# Altium project Luna v2.PrjPcb (part 3 of 7)

## Sheet 06 MIMXRT1170 PART2.SchDoc: Luna v2
size A2; VersionControl_RevNumber: DNP; IsUserConfigurable: DNP; OrgAddr3: Sunrise FL 33323; OrgName: Pixels on Target; Page Create Date: March  8, 1995; Page Number: 5; Page Size: A2; Page Count: 14; OrgAddr2: Suite #104; RevCode: A; Doc: SCH30-00070-00; DsnPath: C:\Users\Carter Nichols\Documents\BitBucket boards (Cadence)\30-00070-00_Original\SCH30-00070-00.DSN; SchematicName: SC30-00070-00; PageName: 05-POWER IN; PageSize: A2; TopSchematic: True; Address4: United States
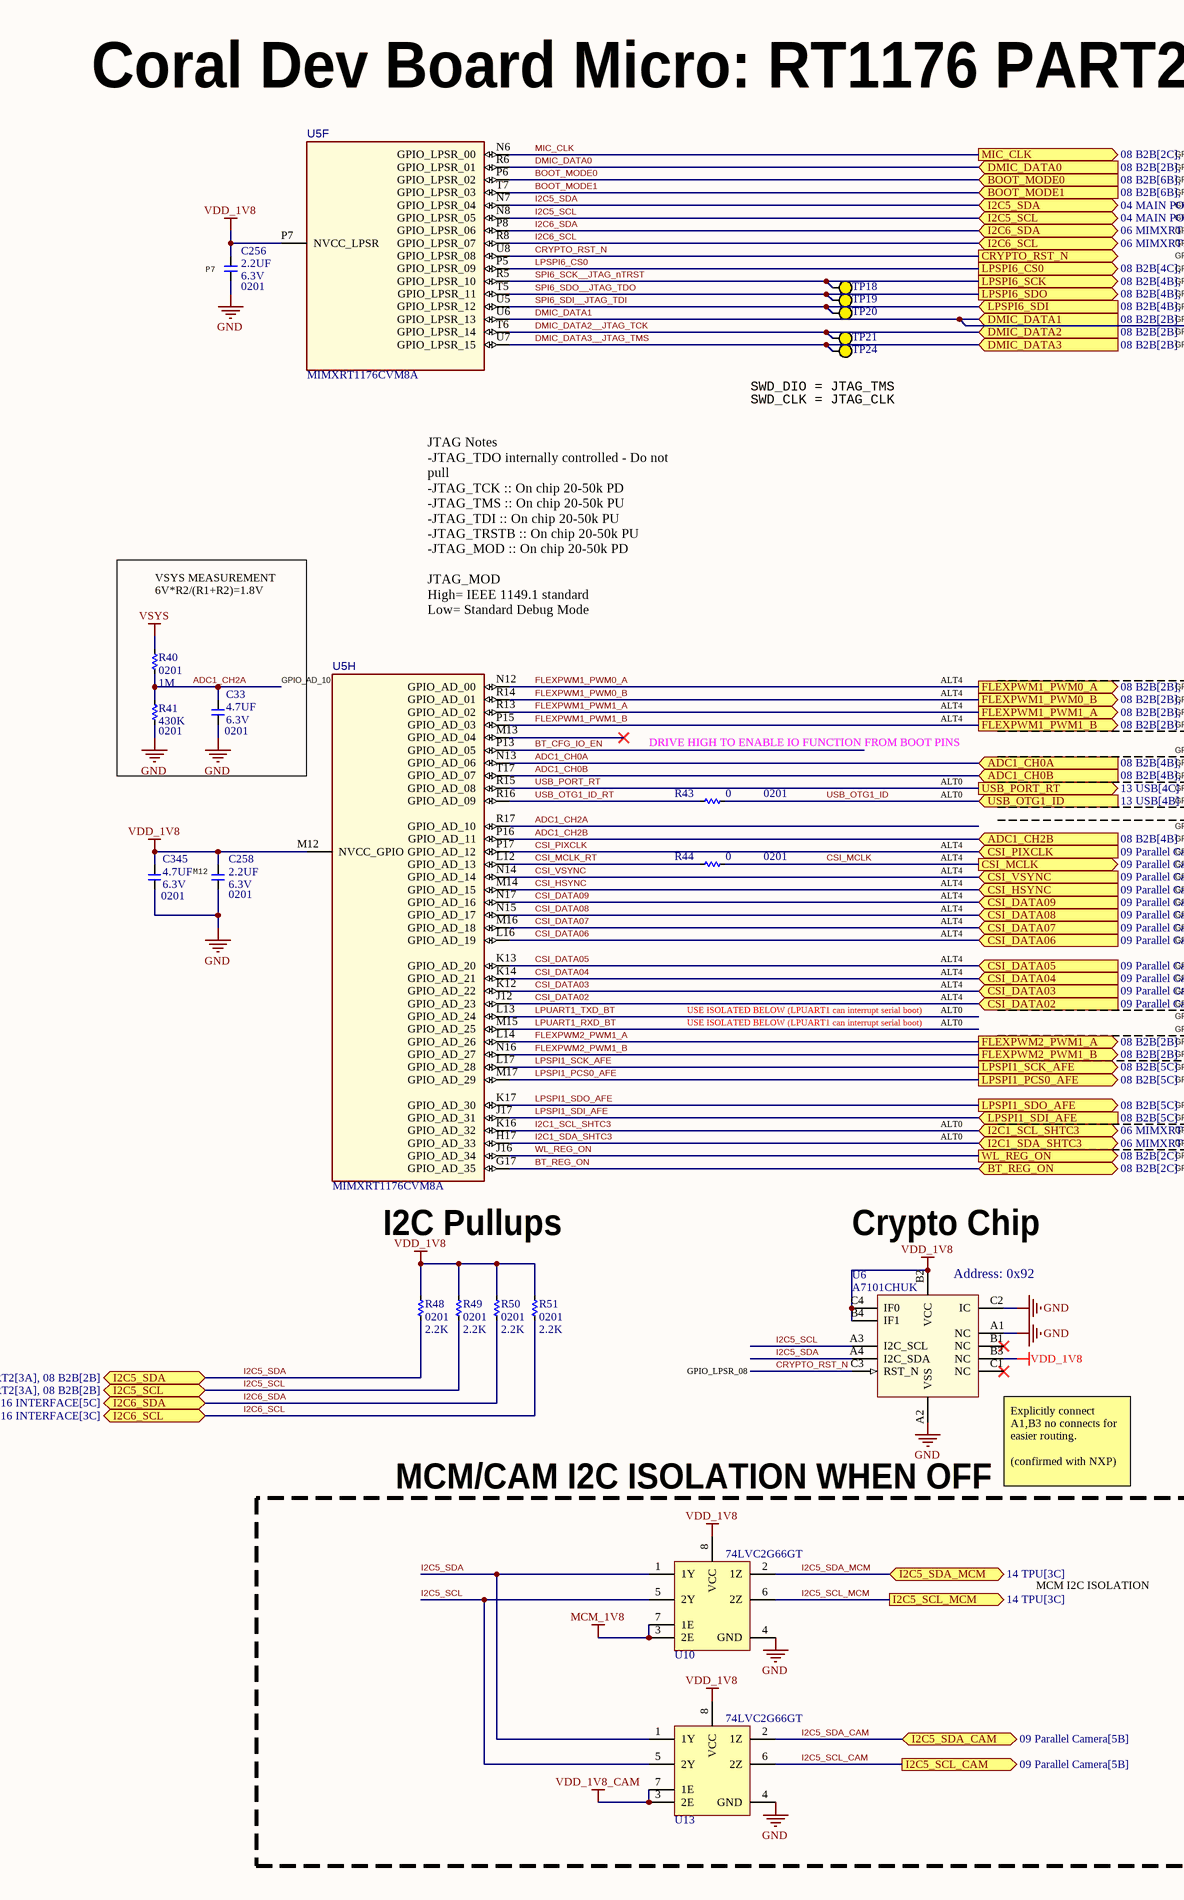
[diagram p9: 06 MIMXRT1170 PART2.SchDoc, left]
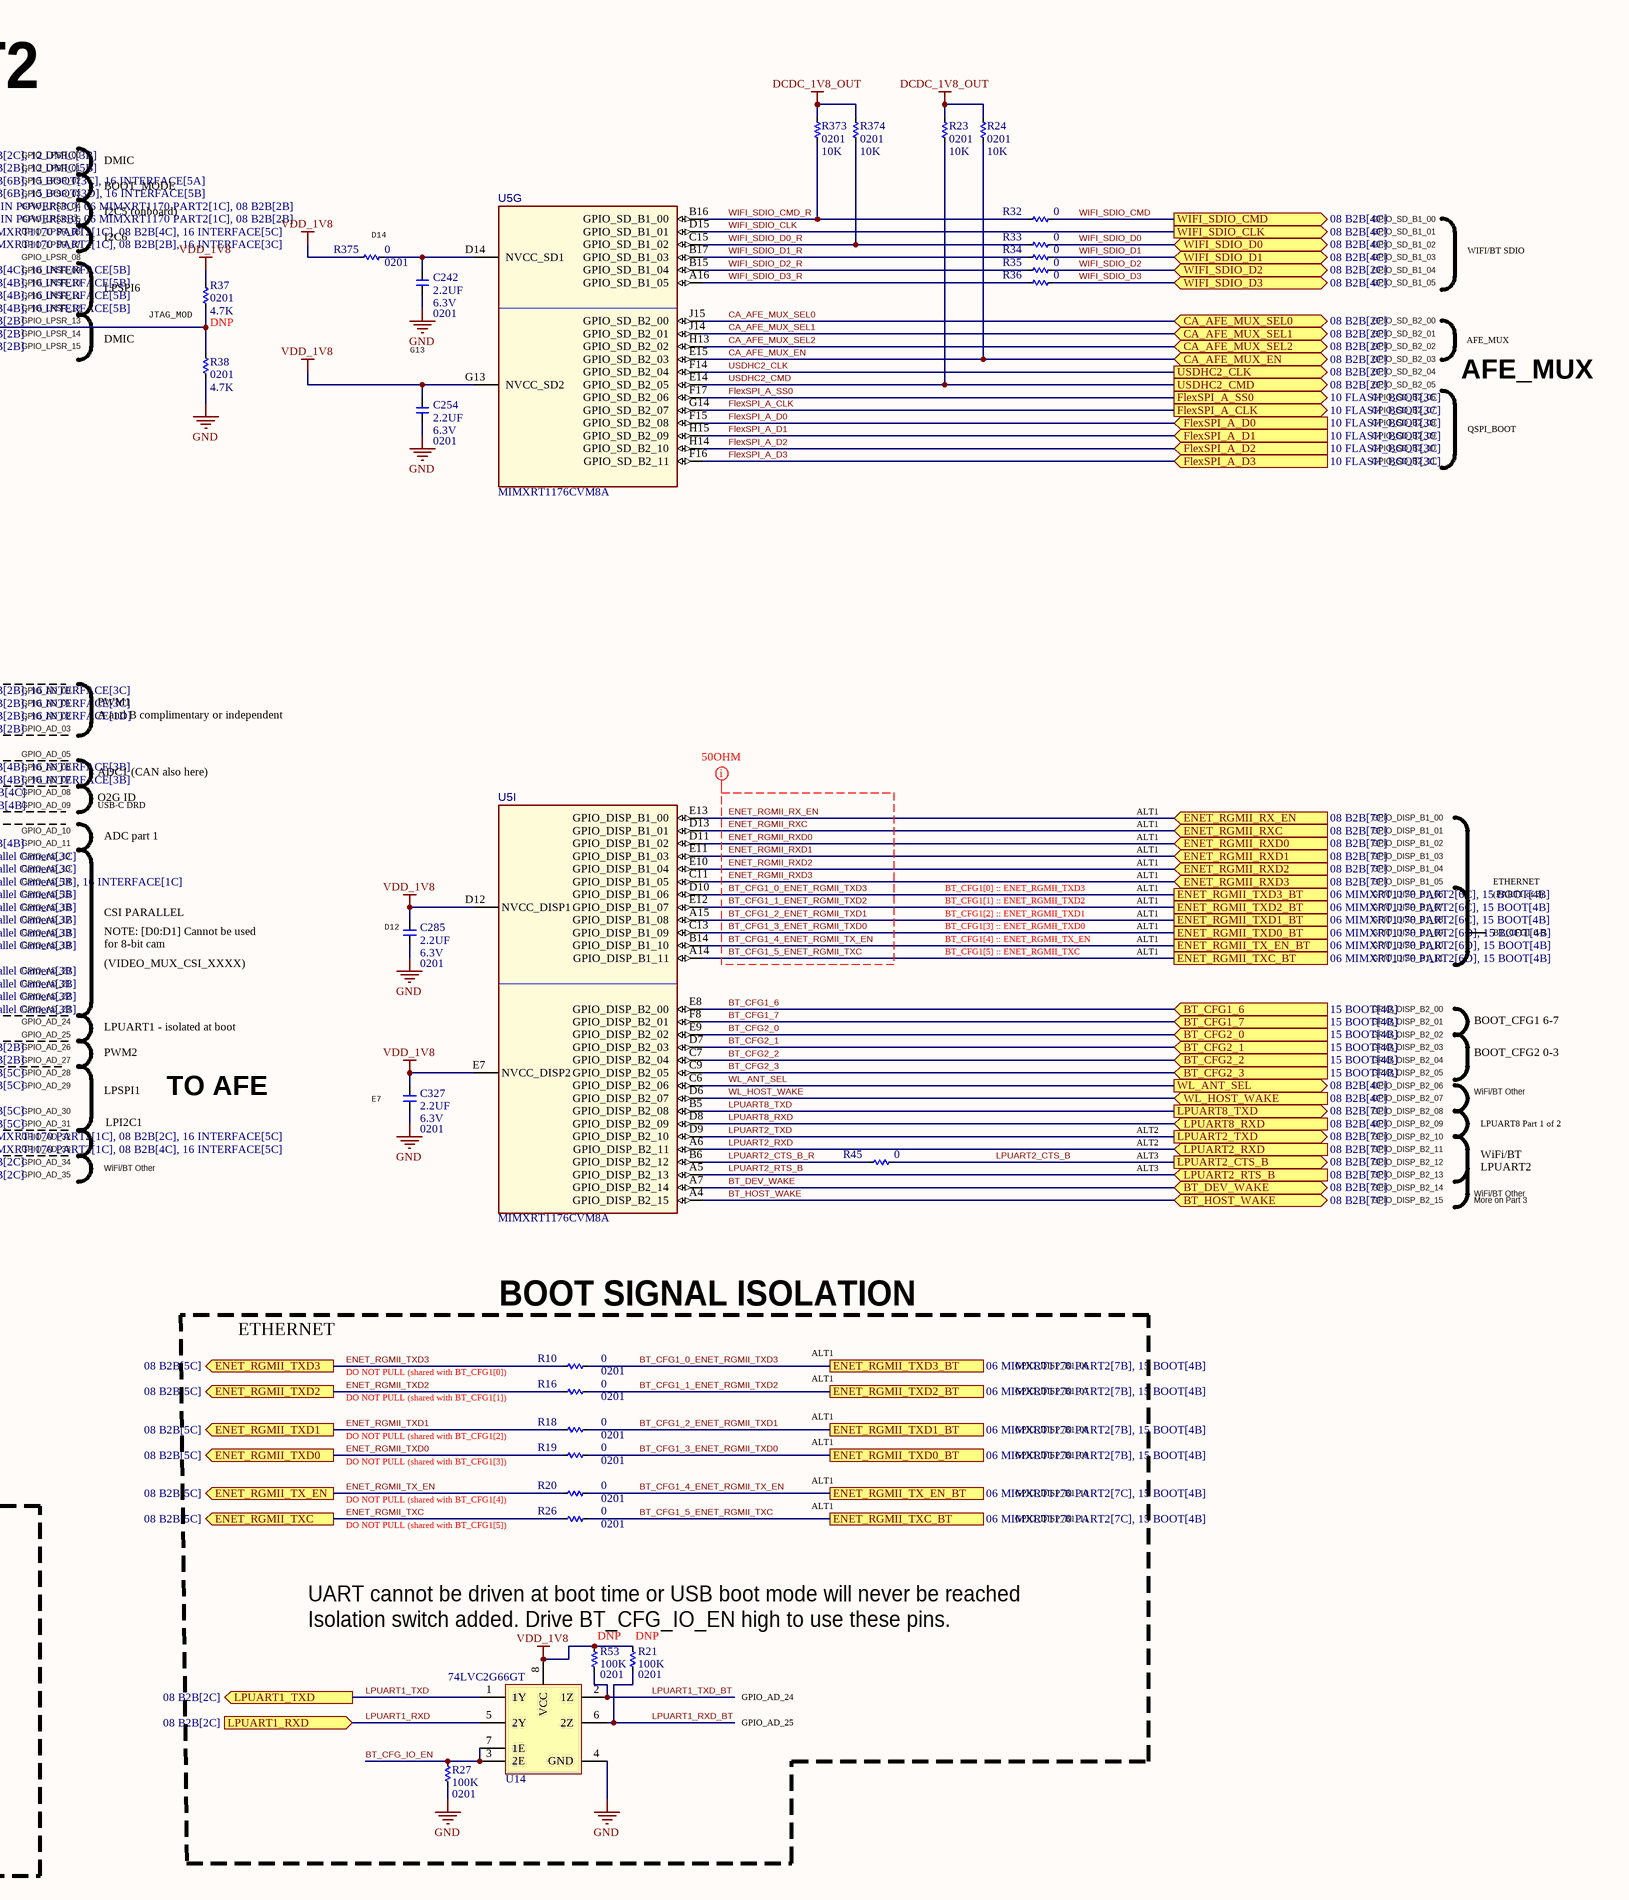
[diagram p10: 06 MIMXRT1170 PART2.SchDoc, right]

### Parts
C33  value 4.7UF  Package: 0201  Voltage: 6.3V  [C0201Y]  (hidden comment: __Template_Cap)
C242  value 2.2UF  Package: 0201  Voltage: 6.3V  [C0201_H0.39MM]  (hidden comment: __Template_Cap)
C254  value 2.2UF  Package: 0201  Voltage: 6.3V  [C0201_H0.39MM]  (hidden comment: __Template_Cap)
C256  value 2.2UF  Package: 0201  Voltage: 6.3V  [C0201_H0.39MM]  (hidden comment: __Template_Cap)
C258  value 2.2UF  Package: 0201  Voltage: 6.3V  [C0201_H0.39MM]  (hidden comment: __Template_Cap)
C285  value 2.2UF  Package: 0201  Voltage: 6.3V  [C0201_H0.39MM]  (hidden comment: __Template_Cap)
C327  value 2.2UF  Package: 0201  Voltage: 6.3V  [C0201_H0.39MM]  (hidden comment: __Template_Cap)
C345  value 4.7UF  Package: 0201  Voltage: 6.3V  [C0201Y]  (hidden comment: __Template_Cap)
R10  value 0  Package: 0201  [R0201]
R16  value 0  Package: 0201  [R0201]
R18  value 0  Package: 0201  [R0201]
R19  value 0  Package: 0201  [R0201]
R20  value 0  Package: 0201  [R0201]
R21  value 100K  Package: 0201  [R0201]
R23  value 10K  Package: 0201  [R0201]
R24  value 10K  Package: 0201  [R0201]
R26  value 0  Package: 0201  [R0201]
R27  value 100K  Package: 0201  [R0201]
R32  value 0  [R0201]
R33  value 0  [R0201]
R34  value 0  [R0201]
R35  value 0  [R0201]
R36  value 0  [R0201]
R37  value 4.7K  Package: 0201  [R0201]
R38  value 4.7K  Package: 0201  [R0201]
R40  value 1M  Package: 0201  [R0201]
R41  value 430K  Package: 0201  [R0201]
R43  value 0  Package: 0201  [R0201]
R44  value 0  Package: 0201  [R0201]
R45  value 0  [R0201]
R48  value 2.2K  Package: 0201  [R0201]
R49  value 2.2K  Package: 0201  [R0201]
R50  value 2.2K  Package: 0201  [R0201]
R51  value 2.2K  Package: 0201  [R0201]
R53  value 100K  Package: 0201  [R0201]
R373  value 10K  Package: 0201  [R0201]
R374  value 10K  Package: 0201  [R0201]
R375  value 0  Package: 0201  [R0201]
TP18  TESTPAD_30MIL  [TESTPAD_SMT_30MIL]  (value not drawn)  (no BOM)
TP19  TESTPAD_30MIL  [TESTPAD_SMT_30MIL]  (value not drawn)  (no BOM)
TP20  TESTPAD_30MIL  [TESTPAD_SMT_30MIL]  (value not drawn)  (no BOM)
TP21  TESTPAD_30MIL  [TESTPAD_SMT_30MIL]  (value not drawn)  (no BOM)
TP24  TESTPAD_30MIL  [TESTPAD_SMT_30MIL]  (value not drawn)  (no BOM)
U5  MFG P/N: MIMXRT1176CVM8A  [BGA289C80P17X17_1400X14000X152]  (hidden comment: MCU_MIMXRT1176CVM8A)  (parts F,G,H,I of 12)
U6  MFG P/N: A7101CHUK  [BGA12C50+3X4_206X202X65]  (hidden comment: SECUR_AUTH_A7101CHUK)
U10  74LVC2G66GT  [SON8_0P5_1L95x1W]
U13  74LVC2G66GT  [SON8_0P5_1L95x1W]
U14  74LVC2G66GT  [SON8_0P5_1L95x1W]

### Blocks framed on the sheet
BOOT SIGNAL ISOLATION: R10 R16 R18-R21 R26 R27 R53 U14
MCM/CAM I2C ISOLATION WHEN OFF: U10 U13

### Ports
ADC1_CH0A (in, see 08 B2B[4B], 16 INTERFACE[3B]), ADC1_CH0B (in, see 08 B2B[4B], 16 INTERFACE[3B]), ADC1_CH2B (in, see 08 B2B[4B]), BOOT_MODE0 (in, see 08 B2B[6B], 15 BOOT[3C], 16 INTERFACE[5A]), BOOT_MODE1 (in, see 08 B2B[6B], 15 BOOT[3D], 16 INTERFACE[5B]), BT_CFG1_6 (in, see 15 BOOT[4B]), BT_CFG1_7 (in, see 15 BOOT[4B]), BT_CFG2_0 (in, see 15 BOOT[4B]), BT_CFG2_1 (in, see 15 BOOT[4B]), BT_CFG2_2 (in, see 15 BOOT[4B]), BT_CFG2_3 (in, see 15 BOOT[4B]), BT_DEV_WAKE (bidir, see 08 B2B[7C]), BT_HOST_WAKE (bidir, see 08 B2B[7C]), BT_REG_ON (bidir, see 08 B2B[2C]), CA_AFE_MUX_EN (bidir, see 08 B2B[2C]), CA_AFE_MUX_SEL0 (bidir, see 08 B2B[2C]), CA_AFE_MUX_SEL1 (bidir, see 08 B2B[2C]), CA_AFE_MUX_SEL2 (bidir, see 08 B2B[2C]), CRYPTO_RST_N (out), CSI_DATA02 (in, see 09 Parallel Camera[3B]), CSI_DATA03 (in, see 09 Parallel Camera[3B]), CSI_DATA04 (in, see 09 Parallel Camera[3B]), CSI_DATA05 (in, see 09 Parallel Camera[3B]), CSI_DATA06 (in, see 09 Parallel Camera[3B]), CSI_DATA07 (in, see 09 Parallel Camera[3B]), CSI_DATA08 (in, see 09 Parallel Camera[3B]), CSI_DATA09 (in, see 09 Parallel Camera[3B]), CSI_HSYNC (in, see 09 Parallel Camera[5B]), CSI_MCLK (out, see 09 Parallel Camera[3C]), CSI_PIXCLK (in, see 09 Parallel Camera[3C]), CSI_VSYNC (in, see 09 Parallel Camera[5B], 16 INTERFACE[1C]), DMIC_DATA0 (in, see 08 B2B[2B], 12 DMIC[5B]), DMIC_DATA1 (in, see 08 B2B[2B]), DMIC_DATA2 (in, see 08 B2B[2B]), DMIC_DATA3 (in, see 08 B2B[2B]), ENET_RGMII_RX_EN (in, see 08 B2B[7C]), ENET_RGMII_RXC (in, see 08 B2B[7C]), ENET_RGMII_RXD0 (in, see 08 B2B[7C]), ENET_RGMII_RXD1 (in, see 08 B2B[7C]), ENET_RGMII_RXD2 (in, see 08 B2B[7C]), ENET_RGMII_RXD3 (in, see 08 B2B[7C]), ENET_RGMII_TX_EN (out, see 08 B2B[5C]), ENET_RGMII_TX_EN_BT (see 06 MIMXRT1170 PART2[6D], 15 BOOT[4B]), ENET_RGMII_TX_EN_BT (see 06 MIMXRT1170 PART2[7C], 15 BOOT[4B]), ENET_RGMII_TXC (out, see 08 B2B[5C]), ENET_RGMII_TXC_BT (see 06 MIMXRT1170 PART2[6D], 15 BOOT[4B]), ENET_RGMII_TXC_BT (see 06 MIMXRT1170 PART2[7C], 15 BOOT[4B]), ENET_RGMII_TXD0 (out, see 08 B2B[5C]), ENET_RGMII_TXD0_BT (see 06 MIMXRT1170 PART2[6D], 15 BOOT[4B]), ENET_RGMII_TXD0_BT (see 06 MIMXRT1170 PART2[7B], 15 BOOT[4B]), ENET_RGMII_TXD1 (out, see 08 B2B[5C]), ENET_RGMII_TXD1_BT (see 06 MIMXRT1170 PART2[6C], 15 BOOT[4B]), ENET_RGMII_TXD1_BT (see 06 MIMXRT1170 PART2[7B], 15 BOOT[4B]), ENET_RGMII_TXD2 (out, see 08 B2B[5C]), ENET_RGMII_TXD2_BT (see 06 MIMXRT1170 PART2[6C], 15 BOOT[4B]), ENET_RGMII_TXD2_BT (see 06 MIMXRT1170 PART2[7B], 15 BOOT[4B]), ENET_RGMII_TXD3 (out, see 08 B2B[5C]), ENET_RGMII_TXD3_BT (see 06 MIMXRT1170 PART2[6C], 15 BOOT[4B]), ENET_RGMII_TXD3_BT (see 06 MIMXRT1170 PART2[7B], 15 BOOT[4B]), FLEXPWM1_PWM0_A (out, see 08 B2B[2B], 16 INTERFACE[3C]), FLEXPWM1_PWM0_B (out, see 08 B2B[2B], 16 INTERFACE[3C]), FLEXPWM1_PWM1_A (out, see 08 B2B[2B], 16 INTERFACE[1D]), FLEXPWM1_PWM1_B (out, see 08 B2B[2B]), FLEXPWM2_PWM1_A (out, see 08 B2B[2B]), FLEXPWM2_PWM1_B (out, see 08 B2B[2B]), FlexSPI_A_CLK (out, see 10 FLASH_BOOT[3C]), FlexSPI_A_D0 (in, see 10 FLASH_BOOT[3C]), FlexSPI_A_D1 (in, see 10 FLASH_BOOT[3C]), FlexSPI_A_D2 (in, see 10 FLASH_BOOT[3C]), FlexSPI_A_D3 (in, see 10 FLASH_BOOT[3C]), FlexSPI_A_SS0 (out, see 10 FLASH_BOOT[3C]), I2C1_SCL_SHTC3 (bidir, see 06 MIMXRT1170 PART2[1C], 08 B2B[2C], 16 INTERFACE[5C]), I2C1_SDA_SHTC3 (bidir, see 06 MIMXRT1170 PART2[1C], 08 B2B[4C], 16 INTERFACE[5C]), I2C5_SCL (bidir, see 04 MAIN POWER[3B], 06 MIMXRT1170 PART2[1C], 08 B2B[2B]), I2C5_SCL (bidir, see 04 MAIN POWER[3B], 06 MIMXRT1170 PART2[3A], 08 B2B[2B]), I2C5_SCL_CAM (out, see 09 Parallel Camera[5B]), I2C5_SCL_MCM (out, see 14 TPU[3C]), I2C5_SDA (bidir, see 04 MAIN POWER[3C], 06 MIMXRT1170 PART2[1C], 08 B2B[2B]), I2C5_SDA (bidir, see 04 MAIN POWER[3C], 06 MIMXRT1170 PART2[3A], 08 B2B[2B]), I2C5_SDA_CAM (bidir, see 09 Parallel Camera[5B]), I2C5_SDA_MCM (bidir, see 14 TPU[3C]), I2C6_SCL (bidir, see 06 MIMXRT1170 PART2[1C], 08 B2B[2B], 16 INTERFACE[3C]), I2C6_SCL (bidir, see 06 MIMXRT1170 PART2[3A], 08 B2B[2B], 16 INTERFACE[3C]), I2C6_SDA (bidir, see 06 MIMXRT1170 PART2[1C], 08 B2B[4C], 16 INTERFACE[5C]), I2C6_SDA (bidir, see 06 MIMXRT1170 PART2[3A], 08 B2B[4C], 16 INTERFACE[5C]), LPSPI1_PCS0_AFE (out, see 08 B2B[5C]), LPSPI1_SCK_AFE (out, see 08 B2B[5C]), LPSPI1_SDI_AFE (in, see 08 B2B[5C]), LPSPI1_SDO_AFE (out, see 08 B2B[5C]), LPSPI6_CS0 (out, see 08 B2B[4C], 16 INTERFACE[5B]), LPSPI6_SCK (out, see 08 B2B[4B], 16 INTERFACE[5B]), LPSPI6_SDI (in, see 08 B2B[4B], 16 INTERFACE[5B]), LPSPI6_SDO (out, see 08 B2B[4B], 16 INTERFACE[5B]), LPUART1_RXD (in, see 08 B2B[2C]), LPUART1_TXD (out, see 08 B2B[2C]), LPUART2_CTS_B (out, see 08 B2B[7C]), LPUART2_RTS_B (in, see 08 B2B[7C]), LPUART2_RXD (in, see 08 B2B[7C]), LPUART2_TXD (out, see 08 B2B[7C]), LPUART8_RXD (in, see 08 B2B[4C]), LPUART8_TXD (out, see 08 B2B[7C]), MIC_CLK (out, see 08 B2B[2C], 12 DMIC[3B]), USB_OTG1_ID (in, see 13 USB[4B]), USB_PORT_RT (out, see 13 USB[4C]), USDHC2_CLK (out, see 08 B2B[2C]), USDHC2_CMD (out, see 08 B2B[2C]), WIFI_SDIO_CLK (out, see 08 B2B[4C]), WIFI_SDIO_CMD (out, see 08 B2B[4C]), WIFI_SDIO_D0 (bidir, see 08 B2B[4C]), WIFI_SDIO_D1 (bidir, see 08 B2B[4C]), WIFI_SDIO_D2 (bidir, see 08 B2B[2C]), WIFI_SDIO_D3 (bidir, see 08 B2B[4C]), WL_ANT_SEL (out, see 08 B2B[4C]), WL_HOST_WAKE (in, see 08 B2B[4C]), WL_REG_ON (out, see 08 B2B[2C])

### Nets
DCDC_1V8_OUT: R23.2 R24.2 R373.2 R374.2
GND: C33.2 C242.2 C254.2 C256.2 C258.2 C285.2 C327.2 C345.2 R27.1 R38.1 R41.1 U6.A1(NC) U6.A2(VSS) U6.C2(IC) U10.4(GND) U13.4(GND) U14.4(GND)
MCM_1V8: U10.3(2E) U10.7(1E)
VDD_1V8: C254.1 C256.1 C258.1 C285.1 C327.1 C345.1 R21.2 R37.2 R48.2 R49.2 R50.2 R51.2 R53.2 R375.1 U5.D12(NVCC_DISP1) U5.E7(NVCC_DISP2) U5.G13(NVCC_SD2) U5.M12(NVCC_GPIO) U5.P7(NVCC_LPSR) U6.B2(VCC) U6.B3(NC) U6.B4(IF1) U6.C4(IF0) U10.8(VCC) U13.8(VCC) U14.8(VCC)
VDD_1V8_CAM: U13.3(2E) U13.7(1E)
VSYS: R40.2
ADC1_CH0A: U5.N13(GPIO_AD_06) ; port ADC1_CH0A
ADC1_CH0B: U5.T17(GPIO_AD_07) ; port ADC1_CH0B
ADC1_CH2A: C33.1 R40.1 R41.2 U5.R17(GPIO_AD_10)
ADC1_CH2B: U5.P16(GPIO_AD_11) ; port ADC1_CH2B
BOOT_MODE0: U5.P6(GPIO_LPSR_02) ; port BOOT_MODE0
BOOT_MODE1: U5.T7(GPIO_LPSR_03) ; port BOOT_MODE1
BT_CFG1_0_ENET_RGMII_TXD3: R10.2 U5.D10(GPIO_DISP_B1_06) ; port ENET_RGMII_TXD3_BT
BT_CFG1_1_ENET_RGMII_TXD2: R16.2 U5.E12(GPIO_DISP_B1_07) ; port ENET_RGMII_TXD2_BT
BT_CFG1_2_ENET_RGMII_TXD1: R18.2 U5.A15(GPIO_DISP_B1_08) ; port ENET_RGMII_TXD1_BT
BT_CFG1_3_ENET_RGMII_TXD0: R19.2 U5.C13(GPIO_DISP_B1_09) ; port ENET_RGMII_TXD0_BT
BT_CFG1_4_ENET_RGMII_TX_EN: R20.2 U5.B14(GPIO_DISP_B1_10) ; port ENET_RGMII_TX_EN_BT
BT_CFG1_5_ENET_RGMII_TXC: R26.2 U5.A14(GPIO_DISP_B1_11) ; port ENET_RGMII_TXC_BT
BT_CFG1_6: U5.E8(GPIO_DISP_B2_00) ; port BT_CFG1_6
BT_CFG1_7: U5.F8(GPIO_DISP_B2_01) ; port BT_CFG1_7
BT_CFG2_0: U5.E9(GPIO_DISP_B2_02) ; port BT_CFG2_0
BT_CFG2_1: U5.D7(GPIO_DISP_B2_03) ; port BT_CFG2_1
BT_CFG2_2: U5.C7(GPIO_DISP_B2_04) ; port BT_CFG2_2
BT_CFG2_3: U5.C9(GPIO_DISP_B2_05) ; port BT_CFG2_3
BT_CFG_IO_EN: R27.2 U5.P13(GPIO_AD_05) U14.3(2E) U14.7(1E)
BT_DEV_WAKE: U5.A7(GPIO_DISP_B2_14) ; port BT_DEV_WAKE
BT_HOST_WAKE: U5.A4(GPIO_DISP_B2_15) ; port BT_HOST_WAKE
BT_REG_ON: U5.G17(GPIO_AD_35) ; port BT_REG_ON
CA_AFE_MUX_EN: R24.1 U5.E15(GPIO_SD_B2_03) ; port CA_AFE_MUX_EN
CA_AFE_MUX_SEL0: U5.J15(GPIO_SD_B2_00) ; port CA_AFE_MUX_SEL0
CA_AFE_MUX_SEL1: U5.J14(GPIO_SD_B2_01) ; port CA_AFE_MUX_SEL1
CA_AFE_MUX_SEL2: U5.H13(GPIO_SD_B2_02) ; port CA_AFE_MUX_SEL2
CRYPTO_RST_N: U5.U8(GPIO_LPSR_08) U6.C3(RST_N) ; port CRYPTO_RST_N
CSI_DATA02: U5.J12(GPIO_AD_23) ; port CSI_DATA02
CSI_DATA03: U5.K12(GPIO_AD_22) ; port CSI_DATA03
CSI_DATA04: U5.K14(GPIO_AD_21) ; port CSI_DATA04
CSI_DATA05: U5.K13(GPIO_AD_20) ; port CSI_DATA05
CSI_DATA06: U5.L16(GPIO_AD_19) ; port CSI_DATA06
CSI_DATA07: U5.M16(GPIO_AD_18) ; port CSI_DATA07
CSI_DATA08: U5.N15(GPIO_AD_17) ; port CSI_DATA08
CSI_DATA09: U5.N17(GPIO_AD_16) ; port CSI_DATA09
CSI_HSYNC: U5.M14(GPIO_AD_15) ; port CSI_HSYNC
CSI_MCLK: R44.2 ; port CSI_MCLK
CSI_MCLK_RT: R44.1 U5.L12(GPIO_AD_13)
CSI_PIXCLK: U5.P17(GPIO_AD_12) ; port CSI_PIXCLK
CSI_VSYNC: U5.N14(GPIO_AD_14) ; port CSI_VSYNC
DMIC_DATA0: U5.R6(GPIO_LPSR_01) ; port DMIC_DATA0
DMIC_DATA1: R37.1 R38.2 U5.U6(GPIO_LPSR_13) ; port DMIC_DATA1
DMIC_DATA2__JTAG_TCK: TP21.1 U5.T6(GPIO_LPSR_14) ; port DMIC_DATA2
DMIC_DATA3__JTAG_TMS: TP24.1 U5.U7(GPIO_LPSR_15) ; port DMIC_DATA3
ENET_RGMII_RX_EN: U5.E13(GPIO_DISP_B1_00) ; port ENET_RGMII_RX_EN
ENET_RGMII_RXC: U5.D13(GPIO_DISP_B1_01) ; port ENET_RGMII_RXC
ENET_RGMII_RXD0: U5.D11(GPIO_DISP_B1_02) ; port ENET_RGMII_RXD0
ENET_RGMII_RXD1: U5.E11(GPIO_DISP_B1_03) ; port ENET_RGMII_RXD1
ENET_RGMII_RXD2: U5.E10(GPIO_DISP_B1_04) ; port ENET_RGMII_RXD2
ENET_RGMII_RXD3: U5.C11(GPIO_DISP_B1_05) ; port ENET_RGMII_RXD3
ENET_RGMII_TX_EN: R20.1 ; port ENET_RGMII_TX_EN
ENET_RGMII_TXC: R26.1 ; port ENET_RGMII_TXC
ENET_RGMII_TXD0: R19.1 ; port ENET_RGMII_TXD0
ENET_RGMII_TXD1: R18.1 ; port ENET_RGMII_TXD1
ENET_RGMII_TXD2: R16.1 ; port ENET_RGMII_TXD2
ENET_RGMII_TXD3: R10.1 ; port ENET_RGMII_TXD3
FLEXPWM1_PWM0_A: U5.N12(GPIO_AD_00) ; port FLEXPWM1_PWM0_A
FLEXPWM1_PWM0_B: U5.R14(GPIO_AD_01) ; port FLEXPWM1_PWM0_B
FLEXPWM1_PWM1_A: U5.R13(GPIO_AD_02) ; port FLEXPWM1_PWM1_A
FLEXPWM1_PWM1_B: U5.P15(GPIO_AD_03) ; port FLEXPWM1_PWM1_B
FLEXPWM2_PWM1_A: U5.L14(GPIO_AD_26) ; port FLEXPWM2_PWM1_A
FLEXPWM2_PWM1_B: U5.N16(GPIO_AD_27) ; port FLEXPWM2_PWM1_B
FlexSPI_A_CLK: U5.G14(GPIO_SD_B2_07) ; port FlexSPI_A_CLK
FlexSPI_A_D0: U5.F15(GPIO_SD_B2_08) ; port FlexSPI_A_D0
FlexSPI_A_D1: U5.H15(GPIO_SD_B2_09) ; port FlexSPI_A_D1
FlexSPI_A_D2: U5.H14(GPIO_SD_B2_10) ; port FlexSPI_A_D2
FlexSPI_A_D3: U5.F16(GPIO_SD_B2_11) ; port FlexSPI_A_D3
FlexSPI_A_SS0: U5.F17(GPIO_SD_B2_06) ; port FlexSPI_A_SS0
I2C1_SCL_SHTC3: U5.K16(GPIO_AD_32) ; port I2C1_SCL_SHTC3
I2C1_SDA_SHTC3: U5.H17(GPIO_AD_33) ; port I2C1_SDA_SHTC3
I2C5_SCL: R49.1 U5.N8(GPIO_LPSR_05) U6.A3(I2C_SCL) U10.5(2Y) U13.5(2Y) ; port I2C5_SCL
I2C5_SCL_CAM: U13.6(2Z) ; port I2C5_SCL_CAM
I2C5_SCL_MCM: U10.6(2Z) ; port I2C5_SCL_MCM
I2C5_SDA: R48.1 U5.N7(GPIO_LPSR_04) U6.A4(I2C_SDA) U10.1(1Y) U13.1(1Y) ; port I2C5_SDA
I2C5_SDA_CAM: U13.2(1Z) ; port I2C5_SDA_CAM
I2C5_SDA_MCM: U10.2(1Z) ; port I2C5_SDA_MCM
I2C6_SCL: R51.1 U5.R8(GPIO_LPSR_07) ; port I2C6_SCL
I2C6_SDA: R50.1 U5.P8(GPIO_LPSR_06) ; port I2C6_SDA
LPSPI1_PCS0_AFE: U5.M17(GPIO_AD_29) ; port LPSPI1_PCS0_AFE
LPSPI1_SCK_AFE: U5.L17(GPIO_AD_28) ; port LPSPI1_SCK_AFE
LPSPI1_SDI_AFE: U5.J17(GPIO_AD_31) ; port LPSPI1_SDI_AFE
LPSPI1_SDO_AFE: U5.K17(GPIO_AD_30) ; port LPSPI1_SDO_AFE
LPSPI6_CS0: U5.P5(GPIO_LPSR_09) ; port LPSPI6_CS0
LPUART1_RXD: U14.5(2Y) ; port LPUART1_RXD
LPUART1_RXD_BT: R21.1 U5.M15(GPIO_AD_25) U14.6(2Z)
LPUART1_TXD: U14.1(1Y) ; port LPUART1_TXD
LPUART1_TXD_BT: R53.1 U5.L13(GPIO_AD_24) U14.2(1Z)
LPUART2_CTS_B: R45.2 ; port LPUART2_CTS_B
LPUART2_CTS_B_R: R45.1 U5.B6(GPIO_DISP_B2_12)
LPUART2_RTS_B: U5.A5(GPIO_DISP_B2_13) ; port LPUART2_RTS_B
LPUART2_RXD: U5.A6(GPIO_DISP_B2_11) ; port LPUART2_RXD
LPUART2_TXD: U5.D9(GPIO_DISP_B2_10) ; port LPUART2_TXD
LPUART8_RXD: U5.D8(GPIO_DISP_B2_09) ; port LPUART8_RXD
LPUART8_TXD: U5.B5(GPIO_DISP_B2_08) ; port LPUART8_TXD
MIC_CLK: U5.N6(GPIO_LPSR_00) ; port MIC_CLK
SPI6_SCK__JTAG_nTRST: TP18.1 U5.R5(GPIO_LPSR_10) ; port LPSPI6_SCK
SPI6_SDI__JTAG_TDI: TP20.1 U5.U5(GPIO_LPSR_12) ; port LPSPI6_SDI
SPI6_SDO__JTAG_TDO: TP19.1 U5.T5(GPIO_LPSR_11) ; port LPSPI6_SDO
USB_OTG1_ID: R43.2 ; port USB_OTG1_ID
USB_OTG1_ID_RT: R43.1 U5.R16(GPIO_AD_09)
USB_PORT_RT: U5.R15(GPIO_AD_08) ; port USB_PORT_RT
USDHC2_CLK: U5.F14(GPIO_SD_B2_04) ; port USDHC2_CLK
USDHC2_CMD: R23.1 U5.E14(GPIO_SD_B2_05) ; port USDHC2_CMD
WIFI_SDIO_CLK: U5.D15(GPIO_SD_B1_01) ; port WIFI_SDIO_CLK
WIFI_SDIO_CMD: R32.2 ; port WIFI_SDIO_CMD
WIFI_SDIO_CMD_R: R32.1 R373.1 U5.B16(GPIO_SD_B1_00)
WIFI_SDIO_D0: R33.2 ; port WIFI_SDIO_D0
WIFI_SDIO_D0_R: R33.1 R374.1 U5.C15(GPIO_SD_B1_02)
WIFI_SDIO_D1: R34.2 ; port WIFI_SDIO_D1
WIFI_SDIO_D1_R: R34.1 U5.B17(GPIO_SD_B1_03)
WIFI_SDIO_D2: R35.2 ; port WIFI_SDIO_D2
WIFI_SDIO_D2_R: R35.1 U5.B15(GPIO_SD_B1_04)
WIFI_SDIO_D3: R36.2 ; port WIFI_SDIO_D3
WIFI_SDIO_D3_R: R36.1 U5.A16(GPIO_SD_B1_05)
WL_ANT_SEL: U5.C6(GPIO_DISP_B2_06) ; port WL_ANT_SEL
WL_HOST_WAKE: U5.D6(GPIO_DISP_B2_07) ; port WL_HOST_WAKE
WL_REG_ON: U5.J16(GPIO_AD_34) ; port WL_REG_ON
NetC242_1: C242.1 R375.2 U5.D14(NVCC_SD1)

Not connected (* = marked no-connect by the designer): U5 M13(GPIO_AD_04)*; U6 B1(NC)* C1(NC)*

### Layout directives
net class 50OHM: BT_CFG1_0_ENET_RGMII_TXD3, BT_CFG1_1_ENET_RGMII_TXD2, BT_CFG1_2_ENET_RGMII_TXD1, BT_CFG1_3_ENET_RGMII_TXD0, BT_CFG1_4_ENET_RGMII_TX_EN, BT_CFG1_5_ENET_RGMII_TXC, ENET_RGMII_RX_EN, ENET_RGMII_RXC, ENET_RGMII_RXD0, ENET_RGMII_RXD1, ENET_RGMII_RXD2, ENET_RGMII_RXD3

### Notes on the sheet
- Coral Dev Board Micro: RT1176 PART2
- GPIO_LPSR_00
- GPIO_LPSR_01
- GPIO_LPSR_02
- DMIC
- GPIO_LPSR_03
- GPIO_LPSR_04
- GPIO_LPSR_05
- GPIO_LPSR_06
- I2C5 (onboard)
- I2C6
- BOOT_MODE
- (near R375) D14
- GPIO_SD_B1_00
- GPIO_SD_B1_01
- (near C256) P7
- GPIO_LPSR_07
- GPIO_LPSR_08
- GPIO_LPSR_09
- GPIO_LPSR_10
- GPIO_LPSR_11
- GPIO_LPSR_12
- LPSPI6
- GPIO_SD_B1_02
- GPIO_SD_B1_03
- GPIO_SD_B1_04
- GPIO_SD_B1_05
- WIFI/BT SDIO
- GPIO_LPSR_13
- GPIO_LPSR_14
- GPIO_LPSR_15
- (near R37) JTAG_MOD
- G13
- GPIO_SD_B2_00
- GPIO_SD_B2_01
- GPIO_SD_B2_02
- GPIO_SD_B2_03
- AFE_MUX
- SWD_DIO = JTAG_TMS
- SWD_CLK = JTAG_CLK
- GPIO_SD_B2_04
- GPIO_SD_B2_05
- GPIO_SD_B2_06
- GPIO_SD_B2_07
- GPIO_SD_B2_08
- GPIO_SD_B2_09
- QSPI_BOOT
- GPIO_SD_B2_10
- GPIO_SD_B2_11
- VSYS MEASUREMENT
- 6V*R2/(R1+R2)=1.8V
- (near U5) GPIO_AD_10
- (near U5) JTAG Notes
  -JTAG_TDO internally controlled - Do not pull
  -JTAG_TCK	:: On chip 20-50k PD
  -JTAG_TMS	:: On chip 20-50k PU
  -JTAG_TDI	:: On chip 20-50k PU
  -JTAG_TRSTB	:: On chip 20-50k PU
  -JTAG_MOD	:: On chip 20-50k PD
  JTAG_MOD
  High= IEEE 1149.1 standard
  Low= Standard Debug Mode
- ALT4
- GPIO_AD_00
- DRIVE HIGH TO ENABLE IO FUNCTION FROM BOOT PINS
- GPIO_AD_01
- GPIO_AD_02
- GPIO_AD_03
- PWM1
- A and B complimentary or independent
- ALT0
- GPIO_AD_05
- GPIO_AD_06
- GPIO_AD_07
- GPIO_AD_08
- GPIO_AD_09
- USB-C DRD
- ADC1 (CAN also here)
- O2G ID
- ALT1
- GPIO_DISP_B1_00
- (near C258) M12
- GPIO_AD_10
- GPIO_AD_11
- GPIO_AD_12
- GPIO_AD_13
- ADC part 1
- GPIO_DISP_B1_01
- GPIO_DISP_B1_02
- GPIO_DISP_B1_03
- GPIO_DISP_B1_04
- GPIO_AD_14
- GPIO_AD_15
- GPIO_AD_16
- GPIO_AD_17
- GPIO_AD_18
- GPIO_AD_19
- CSI PARALLEL
- NOTE: [D0:D1] Cannot be used
- for 8-bit cam
- (near C285) D12
- BT_CFG1[0] :: ENET_RGMII_TXD3
- BT_CFG1[1] :: ENET_RGMII_TXD2
- BT_CFG1[2] :: ENET_RGMII_TXD1
- BT_CFG1[3] :: ENET_RGMII_TXD0
- BT_CFG1[4] :: ENET_RGMII_TX_EN
- GPIO_DISP_B1_05
- GPIO_DISP_B1_06
- GPIO_DISP_B1_07
- GPIO_DISP_B1_08
- GPIO_DISP_B1_09
- GPIO_DISP_B1_10
- ETHERNET
- (PART1 of 3)
- BT_CFG1 0-5
- GPIO_AD_20
- GPIO_AD_21
- GPIO_AD_22
- (VIDEO_MUX_CSI_XXXX)
- BT_CFG1[5] :: ENET_RGMII_TXC
- GPIO_DISP_B1_11
- USE ISOLATED BELOW (LPUART1 can interrupt serial boot)
- GPIO_AD_23
- GPIO_AD_24
- GPIO_AD_25
- GPIO_AD_26
- GPIO_AD_27
- GPIO_AD_28
- LPUART1 - isolated at boot
- PWM2
- GPIO_DISP_B2_00
- GPIO_DISP_B2_01
- GPIO_DISP_B2_02
- GPIO_DISP_B2_03
- GPIO_DISP_B2_04
- GPIO_DISP_B2_05
- BOOT_CFG2 0-3
- BOOT_CFG1 6-7
- GPIO_AD_29
- GPIO_AD_30
- GPIO_AD_31
- LPSPI1
- LPI2C1
- TO SHTC3
- TO AFE
- (near C327) E7
- ALT2
- GPIO_DISP_B2_07
- GPIO_DISP_B2_08
- GPIO_DISP_B2_09
- GPIO_DISP_B2_06
- WiFi/BT Other
- LPUART8 Part 1 of 2
- GPIO_AD_32
- GPIO_AD_33
- GPIO_AD_34
- GPIO_AD_35
- ALT3
- GPIO_DISP_B2_10
- GPIO_DISP_B2_11
- GPIO_DISP_B2_12
- GPIO_DISP_B2_13
- GPIO_DISP_B2_14
- GPIO_DISP_B2_15
- More on Part 3
- WiFi/BT
- LPUART2
- I2C Pullups
- Crypto Chip
- (near U6) Address: 0x92
- DO NOT PULL (shared with BT_CFG1[0])
- DO NOT PULL (shared with BT_CFG1[1])
- DO NOT PULL (shared with BT_CFG1[2])
- (near U6) Explicitly connect A1,B3 no connects for easier routing.
  (confirmed with NXP)
- DO NOT PULL (shared with BT_CFG1[3])
- DO NOT PULL (shared with BT_CFG1[4])
- DO NOT PULL (shared with BT_CFG1[5])
- MCM I2C ISOLATION
- UART cannot be driven at boot time or USB boot mode will never be reached
- Isolation switch added. Drive BT_CFG_IO_EN high to use these pins.
- Title
- Size:
- Date:
- File:
- A2
- Number:
- Time:
- Revision:
- Sheet
- of

### Library data of the parts
C33 C345 = 1199: CAP, CER, X5R, 4.7uF, 20%, 6.3V, 0201; ID: 1199; MFG: MURATA; MFG P/N: GRM035R60J475ME15D; XPN: 150-01224-00; PROXY: 150-03477-00; Status: Released; Dielectric: X5R; Tolerance: 20%; Height: 0.33mm T; ComponentLink1Description: Datasheet; COMMON: 150-01224-00; LOON: 150-01224-00; Gecko: 150-01224-00
C242 C254 C256 C258 C285 C327 = 1761: CAP, CER, X5R, 2.2uF, 20%, 6.3V, 0201, 0.39mm; ID: 1761; MFG: YAGEO; MFG P/N: CC0201MRX5R5BB225; EPIC: G150-01316-00; Status: In Development; Dielectric: X5R; Tolerance: 20%; Height: 0.39mm; Supplier 1: Digi-Key; HelpURL: https://www.digikey.com/product-detail/en/yageo/CC0201MRX5R5BB225/311-3473-1-ND/7164494; ComponentLink1Description: Datasheet; ComponentLink1URL: http://www.yageo.com/documents/recent/UPY-GPHC_X5R_4V-to-50V_25.pdf; Supplier Part Number 1: 311-3473-1-ND
R10 R16 R18-R20 R26 R32-R36 R43-R45 R375 = 8315: RES, 0.0, 1/20W, 0201; ID: 8315; MFG: PANASONIC; MFG P/N: ERJ1GN0R00C; Tolerance: JUMPER; COMMON: 470-00013-00; PROXY: Use ID #6940; Status: Released; Power: 1/20W; LOON: 470-00013-00; Gecko: 470-00013-00; XPN: 470-00013-00
R21 R53 = 6760: RES, 100K, 1%, 1/20W, 0201; ID: 6760; MFG: PANASONIC; MFG P/N: ERJ1GNF1003C; COMMON: 470-00506-00; Status: Released; Power: 1/20W; Tolerance: 1%; LOON: 470-00506-00; Gecko: 470-00506-00; XPN: 470-00506-00; DNP: DNP
R23 R24 R373 R374 = 4151: RES, 10K, 1%, 1/20W, 0201; ID: 4151; MFG: YAGEO; MFG P/N: RC0201FR-0710KL; COMMON: 470-00033-00; PROXY: 470-16076-00; Status: Released; Power: 1/20W; Tolerance: 1%; Height: 0.26mm; Supplier 1: Digi-Key; LOON: 470-00033-00; Gecko: 470-00033-00; XPN: 470-00033-00; Supplier Part Number 1: 311-10.0KMCT-ND
R27 = 7818: RES, 100K, 1%, 1/20W, 0201; ID: 7818; MFG: PANASONIC; MFG P/N: ERJ1GEF1003C; COMMON: 470-00506-00; Status: NRND; Power: 1/20W; Tolerance: 1%; LOON: 470-00506-00; Gecko: 470-00506-00; XPN: 470-00506-00
R37 R38 = 6602: RES, 4.7K, 5%, 1/20W, 0201; ID: 6602; MFG: YAGEO; MFG P/N: RC0201JR-074K7L; COMMON: 470-00012-00; Status: Released; Power: 1/20W; Tolerance: 5%; LOON: 470-00012-00; Gecko: 470-00012-00; XPN: 470-00012-00
  R37: DNP: DNP
R40 = 7806: RES, 1M, 1%, 1/20W, 0201; ID: 7806; MFG: PANASONIC; MFG P/N: ERJ1GEF1004C; COMMON: 470-00029-00; Status: NRND; Power: 1/20W; Tolerance: 1%; LOON: 470-00029-00; Gecko: 470-00029-00; XPN: 470-00029-00
R41 = 5484: Resistor, 430K Ohms, 0201, 0.05W, ±1%; ID: 5484; MFG: PANASONIC; MFG P/N: ERJ-1GEF4303C; Power: 1/20W; COMMON: 470-08715-00; XPN: XS-10019223; Status: NRND; Tolerance: 1%; Height: 0.26mm; Supplier 1: Digi-Key; LOON: 470-08715-00; Gecko: 470-08715-00; Supplier Part Number 1: P430KABCT-ND
R48-R51 = 7086: RES, 2.2K, 5%, 1/20W, 0201; ID: 7086; MFG: YAGEO; MFG P/N: RC0201JR-072K2L; COMMON: 470-00331-00; Status: Released; Power: 1/20W; Tolerance: 5%; XPN: 470-00331-00
TP18-TP21 TP24 = 178: TESTPAD_SMT_30MIL; ID: 178; MFG: _PCB Feature; Status: Released; ComponentLink1URL: _PCB Feature
U5 = 117: IC, PROCESSOR, MIMXRT1176CV, ARM CORTEX-M4/M7, 2MB RAM, SDRAM, WLAN, BGA-289; ID: 117; MFG: NXP Semiconductors; Status: Released; Package: BGA-289; Category: Integrated Circuits (ICs); RoHS Compliant: Yes; ComponentLink1Description: Datasheet; ComponentLink1URL: https://drive.google.com/file/d/1FTzS3WjHycHWpbzAg-R_xAViv5bKJdqv/view; Height: 1.52mm
U6 = 122: IC, MICRO CONTROLLER, A7101, MX51, SECURITY, TEMP, AUTHENTICATION, I2C, WLCSP-12; ID: 122; MFG: NXP USA Inc.; Status: Released; Package: 12-WLCSP (2.06x2.02); Category: Integrated Circuits (ICs); RoHS Compliant: Yes; Supplier 1: Digi-Key; HelpURL: https://www.digikey.com/en/products/detail/nxp-usa-inc/A7101CHUK-T0BC2HAZ/9664256?s=N4IgTCBcDaIIIHYCMAGJBhAEgVQNIgF0BfIA; ComponentLink1Description: Datasheet; ComponentLink1URL: https://www.nxp.com/docs/en/data-sheet/A71CH-SDS.pdf; Height: 0.65mm; Supplier Part Number 1: 568-14698-2-ND
U10 U13 U14 = 74LVC2G66GT: SPST 2x, 1.65V ~ 5.5V, XSON8, 500MHz at 50Ohm; Help URL: https://www.digikey.com/en/products/detail/nexperia-usa-inc/74LVC2G66GT115/1300857

## Sheet 07 MIMXRT1170 PART3.SchDoc: Luna v2
size A2; VersionControl_RevNumber: DNP; IsUserConfigurable: DNP; OrgAddr3: Sunrise FL 33323; OrgName: Pixels on Target; Page Create Date: March  8, 1995; Page Number: 5; Page Size: A2; Page Count: 14; OrgAddr2: Suite #104; RevCode: A; Doc: SCH30-00070-00; DsnPath: C:\Users\Carter Nichols\Documents\BitBucket boards (Cadence)\30-00070-00_Original\SCH30-00070-00.DSN; SchematicName: SC30-00070-00; PageName: 05-POWER IN; PageSize: A2; TopSchematic: True; Address4: United States
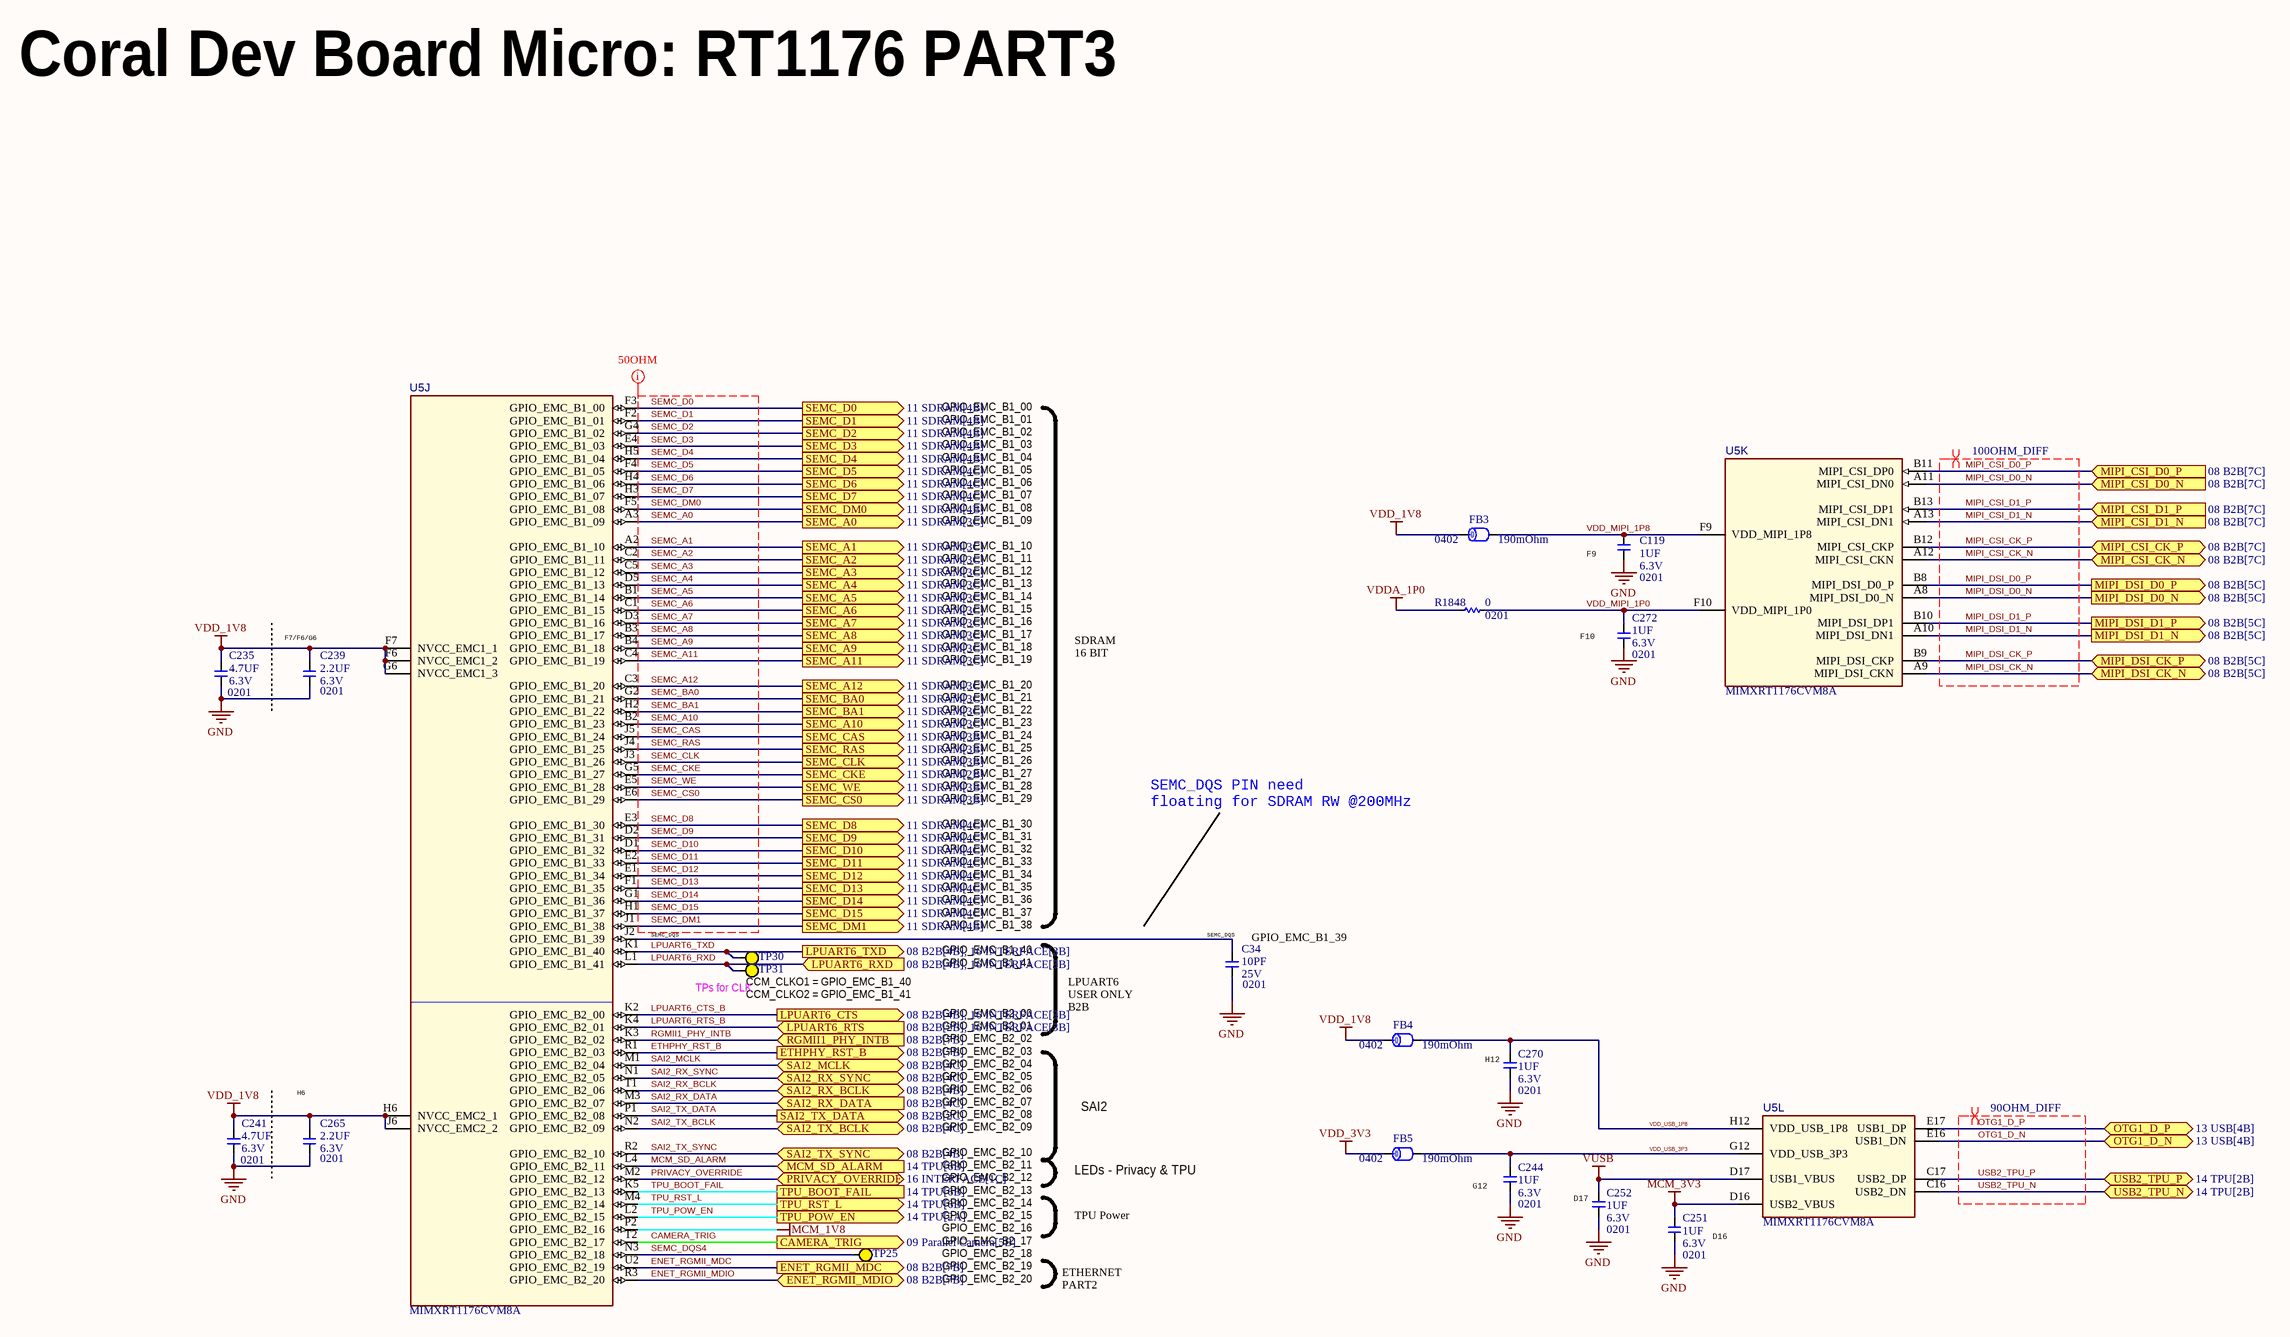
[diagram p11: 07 MIMXRT1170 PART3.SchDoc]

### Parts
C34  value 10PF  Package: 0201  Voltage: 25V  [C0201Y]  (hidden comment: __Template_Cap)
C119  value 1UF  Package: 0201  Voltage: 6.3V  [C0201_H0.39MM]  (hidden comment: __Template_Cap)
C235  value 4.7UF  Package: 0201  Voltage: 6.3V  [C0201Y]  (hidden comment: __Template_Cap)
C239  value 2.2UF  Package: 0201  Voltage: 6.3V  [C0201_H0.39MM]  (hidden comment: __Template_Cap)
C241  value 4.7UF  Package: 0201  Voltage: 6.3V  [C0201Y]  (hidden comment: __Template_Cap)
C244  value 1UF  Package: 0201  Voltage: 6.3V  [C0201_H0.39MM]  (hidden comment: __Template_Cap)
C251  value 1UF  Package: 0201  Voltage: 6.3V  [C0201_H0.39MM]  (hidden comment: __Template_Cap)
C252  value 1UF  Package: 0201  Voltage: 6.3V  [C0201_H0.39MM]  (hidden comment: __Template_Cap)
C265  value 2.2UF  Package: 0201  Voltage: 6.3V  [C0201_H0.39MM]  (hidden comment: __Template_Cap)
C270  value 1UF  Package: 0201  Voltage: 6.3V  [C0201_H0.39MM]  (hidden comment: __Template_Cap)
C272  value 1UF  Package: 0201  Voltage: 6.3V  [C0201_H0.39MM]  (hidden comment: __Template_Cap)
FB3  Package: 0402  Rdc max: 190mOhm  [L0402_H0.55MM]  (hidden comment: __Template_Ferrite_Bead)
FB4  Package: 0402  Rdc max: 190mOhm  [L0402_H0.55MM]  (hidden comment: __Template_Ferrite_Bead)
FB5  Package: 0402  Rdc max: 190mOhm  [L0402_H0.55MM]  (hidden comment: __Template_Ferrite_Bead)
R1848  value 0  Package: 0201  [R0201]
TP25  TESTPAD_30MIL  [TESTPAD_SMT_30MIL]  (value not drawn)  (no BOM)
TP30  TESTPAD_30MIL  [TESTPAD_SMT_30MIL]  (value not drawn)  (no BOM)
TP31  TESTPAD_30MIL  [TESTPAD_SMT_30MIL]  (value not drawn)  (no BOM)
U5  MFG P/N: MIMXRT1176CVM8A  [BGA289C80P17X17_1400X14000X152]  (hidden comment: MCU_MIMXRT1176CVM8A)  (parts J,K,L of 12)

### Ports
CAMERA_TRIG (out, see 09 Parallel Camera[5B]), ENET_RGMII_MDC (out, see 08 B2B[7B]), ENET_RGMII_MDIO (bidir, see 08 B2B[7B]), ETHPHY_RST_B (out, see 08 B2B[7B]), LPUART6_CTS (out, see 08 B2B[4B], 16 INTERFACE[3B]), LPUART6_RTS (in, see 08 B2B[2B], 16 INTERFACE[3B]), LPUART6_RXD (in, see 08 B2B[4B], 16 INTERFACE[3B]), LPUART6_TXD (out, see 08 B2B[4B], 16 INTERFACE[3B]), MCM_SD_ALARM (in, see 14 TPU[6B]), MIPI_CSI_CK_N (bidir, see 08 B2B[7C]), MIPI_CSI_CK_P (bidir, see 08 B2B[7C]), MIPI_CSI_D0_N (in, see 08 B2B[7C]), MIPI_CSI_D0_P (in, see 08 B2B[7C]), MIPI_CSI_D1_N (in, see 08 B2B[7C]), MIPI_CSI_D1_P (in, see 08 B2B[7C]), MIPI_DSI_CK_N (bidir, see 08 B2B[5C]), MIPI_DSI_CK_P (bidir, see 08 B2B[5C]), MIPI_DSI_D0_N (out, see 08 B2B[5C]), MIPI_DSI_D0_P (out, see 08 B2B[5C]), MIPI_DSI_D1_N (out, see 08 B2B[5C]), MIPI_DSI_D1_P (out, see 08 B2B[5C]), OTG1_D_N (bidir, see 13 USB[4B]), OTG1_D_P (bidir, see 13 USB[4B]), PRIVACY_OVERRIDE (bidir, see 16 INTERFACE[1C]), RGMII1_PHY_INTB (in, see 08 B2B[7B]), SAI2_MCLK (bidir, see 08 B2B[4C]), SAI2_RX_BCLK (bidir, see 08 B2B[4B]), SAI2_RX_DATA (in, see 08 B2B[4C]), SAI2_RX_SYNC (bidir, see 08 B2B[4C]), SAI2_TX_BCLK (bidir, see 08 B2B[4C]), SAI2_TX_DATA (out, see 08 B2B[2C]), SAI2_TX_SYNC (bidir, see 08 B2B[4B]), SEMC_A0 (out, see 11 SDRAM[3C]), SEMC_A1 (out, see 11 SDRAM[3C]), SEMC_A2 (out, see 11 SDRAM[3C]), SEMC_A3 (out, see 11 SDRAM[3C]), SEMC_A4 (out, see 11 SDRAM[3C]), SEMC_A5 (out, see 11 SDRAM[3C]), SEMC_A6 (out, see 11 SDRAM[3C]), SEMC_A7 (out, see 11 SDRAM[3C]), SEMC_A8 (out, see 11 SDRAM[3C]), SEMC_A9 (out, see 11 SDRAM[3C]), SEMC_A10 (out, see 11 SDRAM[3C]), SEMC_A11 (out, see 11 SDRAM[3C]), SEMC_A12 (out, see 11 SDRAM[3C]), SEMC_BA0 (out, see 11 SDRAM[3C]), SEMC_BA1 (out, see 11 SDRAM[3C]), SEMC_CAS (out, see 11 SDRAM[3B]), SEMC_CKE (out, see 11 SDRAM[2B]), SEMC_CLK (out, see 11 SDRAM[3B]), SEMC_CS0 (out, see 11 SDRAM[3B]), SEMC_D0 (out, see 11 SDRAM[4B]), SEMC_D1 (out, see 11 SDRAM[4B]), SEMC_D2 (out, see 11 SDRAM[4B]), SEMC_D3 (out, see 11 SDRAM[4B]), SEMC_D4 (out, see 11 SDRAM[4B]), SEMC_D5 (out, see 11 SDRAM[4C]), SEMC_D6 (out, see 11 SDRAM[4C]), SEMC_D7 (out, see 11 SDRAM[4C]), SEMC_D8 (out, see 11 SDRAM[4C]), SEMC_D9 (out, see 11 SDRAM[4C]), SEMC_D10 (out, see 11 SDRAM[4C]), SEMC_D11 (out, see 11 SDRAM[4C]), SEMC_D12 (out, see 11 SDRAM[4C]), SEMC_D13 (out, see 11 SDRAM[4C]), SEMC_D14 (out, see 11 SDRAM[4C]), SEMC_D15 (out, see 11 SDRAM[4C]), SEMC_DM0 (out, see 11 SDRAM[4B]), SEMC_DM1 (out, see 11 SDRAM[4B]), SEMC_RAS (out, see 11 SDRAM[3B]), SEMC_WE (out, see 11 SDRAM[3B]), TPU_BOOT_FAIL (see 14 TPU[6B]), TPU_POW_EN (out, see 14 TPU[2A]), TPU_RST_L (out, see 14 TPU[6B]), USB2_TPU_N (bidir, see 14 TPU[2B]), USB2_TPU_P (bidir, see 14 TPU[2B])

### Nets
GND: C34.2 C119.2 C235.2 C239.2 C241.2 C244.2 C251.2 C252.2 C265.2 C270.2 C272.2
MCM_1V8: U5.P2(GPIO_EMC_B2_16)
MCM_3V3: C251.1 U5.D16(USB2_VBUS)
VDD_1V8: C235.1 C239.1 C241.1 C265.1 FB3.1 FB4.1 U5.F6(NVCC_EMC1_2) U5.F7(NVCC_EMC1_1) U5.G6(NVCC_EMC1_3) U5.H6(NVCC_EMC2_1) U5.J6(NVCC_EMC2_2)
VDD_3V3: FB5.1
VDDA_1P0: R1848.1
VUSB: C252.1 U5.D17(USB1_VBUS)
CAMERA_TRIG: U5.T2(GPIO_EMC_B2_17) ; port CAMERA_TRIG
ENET_RGMII_MDC: U5.U2(GPIO_EMC_B2_19) ; port ENET_RGMII_MDC
ENET_RGMII_MDIO: U5.R3(GPIO_EMC_B2_20) ; port ENET_RGMII_MDIO
ETHPHY_RST_B: U5.R1(GPIO_EMC_B2_03) ; port ETHPHY_RST_B
LPUART6_CTS_B: U5.K2(GPIO_EMC_B2_00) ; port LPUART6_CTS
LPUART6_RTS_B: U5.K4(GPIO_EMC_B2_01) ; port LPUART6_RTS
LPUART6_RXD: TP31.1 U5.L1(GPIO_EMC_B1_41) ; port LPUART6_RXD
LPUART6_TXD: TP30.1 U5.K1(GPIO_EMC_B1_40) ; port LPUART6_TXD
MCM_SD_ALARM: U5.L4(GPIO_EMC_B2_11) ; port MCM_SD_ALARM
MIPI_CSI_CK_N: U5.A12(MIPI_CSI_CKN) ; port MIPI_CSI_CK_N
MIPI_CSI_CK_P: U5.B12(MIPI_CSI_CKP) ; port MIPI_CSI_CK_P
MIPI_CSI_D0_N: U5.A11(MIPI_CSI_DN0) ; port MIPI_CSI_D0_N
MIPI_CSI_D0_P: U5.B11(MIPI_CSI_DP0) ; port MIPI_CSI_D0_P
MIPI_CSI_D1_N: U5.A13(MIPI_CSI_DN1) ; port MIPI_CSI_D1_N
MIPI_CSI_D1_P: U5.B13(MIPI_CSI_DP1) ; port MIPI_CSI_D1_P
MIPI_DSI_CK_N: U5.A9(MIPI_DSI_CKN) ; port MIPI_DSI_CK_N
MIPI_DSI_CK_P: U5.B9(MIPI_DSI_CKP) ; port MIPI_DSI_CK_P
MIPI_DSI_D0_N: U5.A8(MIPI_DSI_D0_N) ; port MIPI_DSI_D0_N
MIPI_DSI_D0_P: U5.B8(MIPI_DSI_D0_P) ; port MIPI_DSI_D0_P
MIPI_DSI_D1_N: U5.A10(MIPI_DSI_DN1) ; port MIPI_DSI_D1_N
MIPI_DSI_D1_P: U5.B10(MIPI_DSI_DP1) ; port MIPI_DSI_D1_P
OTG1_D_N: U5.E16(USB1_DN) ; port OTG1_D_N
OTG1_D_P: U5.E17(USB1_DP) ; port OTG1_D_P
PRIVACY_OVERRIDE: U5.M2(GPIO_EMC_B2_12) ; port PRIVACY_OVERRIDE
RGMII1_PHY_INTB: U5.K3(GPIO_EMC_B2_02) ; port RGMII1_PHY_INTB
SAI2_MCLK: U5.M1(GPIO_EMC_B2_04) ; port SAI2_MCLK
SAI2_RX_BCLK: U5.T1(GPIO_EMC_B2_06) ; port SAI2_RX_BCLK
SAI2_RX_DATA: U5.M3(GPIO_EMC_B2_07) ; port SAI2_RX_DATA
SAI2_RX_SYNC: U5.N1(GPIO_EMC_B2_05) ; port SAI2_RX_SYNC
SAI2_TX_BCLK: U5.N2(GPIO_EMC_B2_09) ; port SAI2_TX_BCLK
SAI2_TX_DATA: U5.P1(GPIO_EMC_B2_08) ; port SAI2_TX_DATA
SAI2_TX_SYNC: U5.R2(GPIO_EMC_B2_10) ; port SAI2_TX_SYNC
SEMC_A0: U5.A3(GPIO_EMC_B1_09) ; port SEMC_A0
SEMC_A1: U5.A2(GPIO_EMC_B1_10) ; port SEMC_A1
SEMC_A2: U5.C2(GPIO_EMC_B1_11) ; port SEMC_A2
SEMC_A3: U5.C5(GPIO_EMC_B1_12) ; port SEMC_A3
SEMC_A4: U5.D5(GPIO_EMC_B1_13) ; port SEMC_A4
SEMC_A5: U5.B1(GPIO_EMC_B1_14) ; port SEMC_A5
SEMC_A6: U5.C1(GPIO_EMC_B1_15) ; port SEMC_A6
SEMC_A7: U5.D3(GPIO_EMC_B1_16) ; port SEMC_A7
SEMC_A8: U5.B3(GPIO_EMC_B1_17) ; port SEMC_A8
SEMC_A9: U5.B4(GPIO_EMC_B1_18) ; port SEMC_A9
SEMC_A10: U5.B2(GPIO_EMC_B1_23) ; port SEMC_A10
SEMC_A11: U5.C4(GPIO_EMC_B1_19) ; port SEMC_A11
SEMC_A12: U5.C3(GPIO_EMC_B1_20) ; port SEMC_A12
SEMC_BA0: U5.G2(GPIO_EMC_B1_21) ; port SEMC_BA0
SEMC_BA1: U5.H2(GPIO_EMC_B1_22) ; port SEMC_BA1
SEMC_CAS: U5.J5(GPIO_EMC_B1_24) ; port SEMC_CAS
SEMC_CKE: U5.G5(GPIO_EMC_B1_27) ; port SEMC_CKE
SEMC_CLK: U5.J3(GPIO_EMC_B1_26) ; port SEMC_CLK
SEMC_CS0: U5.E6(GPIO_EMC_B1_29) ; port SEMC_CS0
SEMC_D0: U5.F3(GPIO_EMC_B1_00) ; port SEMC_D0
SEMC_D1: U5.F2(GPIO_EMC_B1_01) ; port SEMC_D1
SEMC_D2: U5.G4(GPIO_EMC_B1_02) ; port SEMC_D2
SEMC_D3: U5.E4(GPIO_EMC_B1_03) ; port SEMC_D3
SEMC_D4: U5.H5(GPIO_EMC_B1_04) ; port SEMC_D4
SEMC_D5: U5.F4(GPIO_EMC_B1_05) ; port SEMC_D5
SEMC_D6: U5.H4(GPIO_EMC_B1_06) ; port SEMC_D6
SEMC_D7: U5.H3(GPIO_EMC_B1_07) ; port SEMC_D7
SEMC_D8: U5.E3(GPIO_EMC_B1_30) ; port SEMC_D8
SEMC_D9: U5.D2(GPIO_EMC_B1_31) ; port SEMC_D9
SEMC_D10: U5.D1(GPIO_EMC_B1_32) ; port SEMC_D10
SEMC_D11: U5.E2(GPIO_EMC_B1_33) ; port SEMC_D11
SEMC_D12: U5.E1(GPIO_EMC_B1_34) ; port SEMC_D12
SEMC_D13: U5.F1(GPIO_EMC_B1_35) ; port SEMC_D13
SEMC_D14: U5.G1(GPIO_EMC_B1_36) ; port SEMC_D14
SEMC_D15: U5.H1(GPIO_EMC_B1_37) ; port SEMC_D15
SEMC_DM0: U5.F5(GPIO_EMC_B1_08) ; port SEMC_DM0
SEMC_DM1: U5.J1(GPIO_EMC_B1_38) ; port SEMC_DM1
SEMC_DQS4: TP25.1 U5.N3(GPIO_EMC_B2_18)
SEMC_RAS: U5.J4(GPIO_EMC_B1_25) ; port SEMC_RAS
SEMC_WE: U5.E5(GPIO_EMC_B1_28) ; port SEMC_WE
TPU_BOOT_FAIL: U5.K5(GPIO_EMC_B2_13) ; port TPU_BOOT_FAIL
TPU_POW_EN: U5.L2(GPIO_EMC_B2_15) ; port TPU_POW_EN
TPU_RST_L: U5.M4(GPIO_EMC_B2_14) ; port TPU_RST_L
USB2_TPU_N: U5.C16(USB2_DN) ; port USB2_TPU_N
USB2_TPU_P: U5.C17(USB2_DP) ; port USB2_TPU_P
VDD_MIPI_1P0: C272.1 R1848.2 U5.F10(VDD_MIPI_1P0)
VDD_MIPI_1P8: C119.1 FB3.2 U5.F9(VDD_MIPI_1P8)
VDD_USB_1P8: C270.1 FB4.2 U5.H12(VDD_USB_1P8)
VDD_USB_3P3: C244.1 FB5.2 U5.G12(VDD_USB_3P3)
NetC34_1: C34.1 U5.J2(GPIO_EMC_B1_39)

### Layout directives
differential pair; differential pair class 100OHM_DIFF: MIPI_CSI_CK_N, MIPI_CSI_CK_P, MIPI_CSI_D0_N, MIPI_CSI_D0_P, MIPI_CSI_D1_N, MIPI_CSI_D1_P, MIPI_DSI_CK_N, MIPI_DSI_CK_P, MIPI_DSI_D0_N, MIPI_DSI_D0_P, MIPI_DSI_D1_N, MIPI_DSI_D1_P
differential pair; differential pair class 90OHM_DIFF: OTG1_D_N, OTG1_D_P, USB2_TPU_N, USB2_TPU_P
net class 50OHM: SEMC_A0, SEMC_A1, SEMC_A2, SEMC_A3, SEMC_A4, SEMC_A5, SEMC_A6, SEMC_A7, SEMC_A8, SEMC_A9, SEMC_A10, SEMC_A11, SEMC_A12, SEMC_BA0, SEMC_BA1, SEMC_CAS, SEMC_CKE, SEMC_CLK, SEMC_CS0, SEMC_D0, SEMC_D1, SEMC_D2, SEMC_D3, SEMC_D4, SEMC_D5, SEMC_D6, SEMC_D7, SEMC_D8, SEMC_D9, SEMC_D10, SEMC_D11, SEMC_D12, SEMC_D13, SEMC_D14, SEMC_D15, SEMC_DM0, SEMC_DM1, SEMC_RAS, SEMC_WE

### Notes on the sheet
- Coral Dev Board Micro: RT1176 PART3
- GPIO_EMC_B1_00
- GPIO_EMC_B1_01
- GPIO_EMC_B1_02
- GPIO_EMC_B1_03
- GPIO_EMC_B1_04
- GPIO_EMC_B1_05
- GPIO_EMC_B1_06
- GPIO_EMC_B1_07
- GPIO_EMC_B1_08
- GPIO_EMC_B1_09
- GPIO_EMC_B1_10
- GPIO_EMC_B1_11
- GPIO_EMC_B1_12
- GPIO_EMC_B1_13
- GPIO_EMC_B1_14
- (near C119) F9
- (near C239) F7/F6/G6
- GPIO_EMC_B1_15
- GPIO_EMC_B1_16
- GPIO_EMC_B1_17
- GPIO_EMC_B1_18
- GPIO_EMC_B1_19
- SDRAM
- 16 BIT
- (near C272) F10
- GPIO_EMC_B1_20
- GPIO_EMC_B1_21
- GPIO_EMC_B1_22
- GPIO_EMC_B1_23
- GPIO_EMC_B1_24
- GPIO_EMC_B1_25
- GPIO_EMC_B1_26
- GPIO_EMC_B1_27
- GPIO_EMC_B1_28
- GPIO_EMC_B1_29
- GPIO_EMC_B1_30
- GPIO_EMC_B1_31
- GPIO_EMC_B1_32
- SEMC_DQS PIN need
  floating for SDRAM RW @200MHz
- GPIO_EMC_B1_33
- GPIO_EMC_B1_34
- GPIO_EMC_B1_35
- GPIO_EMC_B1_36
- GPIO_EMC_B1_37
- GPIO_EMC_B1_38
- (near U5) SEMC_DQS
- (near TP31) CCM_CLKO1 = GPIO_EMC_B1_40
- GPIO_EMC_B1_40
- GPIO_EMC_B1_41
- LPUART6
- (near C34) SEMC_DQS
- (near C34) GPIO_EMC_B1_39
- (near TP31) TPs for CLK
- CCM_CLKO2 = GPIO_EMC_B1_41
- GPIO_EMC_B2_00
- GPIO_EMC_B2_01
- GPIO_EMC_B2_02
- GPIO_EMC_B2_03
- USER ONLY
- B2B
- (near C265) H6
- GPIO_EMC_B2_04
- GPIO_EMC_B2_05
- GPIO_EMC_B2_06
- GPIO_EMC_B2_07
- SAI2
- (near C270) H12
- GPIO_EMC_B2_08
- GPIO_EMC_B2_09
- GPIO_EMC_B2_10
- GPIO_EMC_B2_12
- GPIO_EMC_B2_11
- LEDs - Privacy & TPU
- GPIO_EMC_B2_14
- GPIO_EMC_B2_15
- GPIO_EMC_B2_16
- GPIO_EMC_B2_13
- TPU Power
- (near C244) G12
- (near C252) D17
- D16
- GPIO_EMC_B2_18
- GPIO_EMC_B2_19
- GPIO_EMC_B2_20
- GPIO_EMC_B2_17
- ETHERNET
- PART2
- Title
- Size:
- Date:
- File:
- A2
- Number:
- Time:
- Revision:
- Sheet
- of

### Library data of the parts
C34 = 614: CAP, CER, NP0, 10pF, 25V, 5%, 0201, 0.33mm T; ID: 614; MFG: MURATA; MFG P/N: OBS: GRM0335C1E100JD01D; XPN: 150-00028-00; EPIC: G150-00028-00; Status: Released; Dielectric: NP0; Tolerance: 5%; Height: 0.33mm T; ComponentLink1Description: Datasheet; COMMON: 150-00028-00; LOON: 150-00028-00; Gecko: 150-00028-00
C119 C244 C251 C252 C270 C272 = 1771: CAP, CER, X6S, 1uF, 20%, 6.3V, 0201, 0.39mm; ID: 1771; MFG: MURATA; MFG P/N: GRM033C80J105ME05D; EPIC: G150-02531-00; Status: In Development; Dielectric: X6S; Tolerance: 20%; Height: 0.39mm; Supplier 1: Digi-Key; HelpURL: https://www.digikey.com/product-detail/en/murata-electronics-north-america/GRM033C80J105ME05D/490-13218-1-ND/5877426; ComponentLink1Description: Datasheet; ComponentLink1URL: https://psearch.en.murata.com/capacitor/product/GRM033C80J105ME05%23.pdf; Supplier Part Number 1: 490-13218-1-ND
C235 C241 = 1199: as C33 on sheet 06 MIMXRT1170 PART2; Status: Released; Dielectric: X5R; Tolerance: 20%; Height: 0.33mm T; ComponentLink1Description: Datasheet; COMMON: 150-01224-00; LOON: 150-01224-00; Gecko: 150-01224-00
C239 C265 = 1761: as C242 on sheet 06 MIMXRT1170 PART2; Status: In Development; Dielectric: X5R; Tolerance: 20%; Height: 0.39mm; Supplier 1: Digi-Key; HelpURL: https://www.digikey.com/product-detail/en/yageo/CC0201MRX5R5BB225/311-3473-1-ND/7164494; ComponentLink1Description: Datasheet; ComponentLink1URL: http://www.yageo.com/documents/recent/UPY-GPHC_X5R_4V-to-50V_25.pdf; Supplier Part Number 1: 311-3473-1-ND
FB3-FB5 = 913: FERRITE, BEAD, 120 OHMS@100MHZ, 25%, 550mA, 190 mOHM DCR, 0402; ID: 913; Catagory: Ferrite Bead; MFG: Murata Electronics; MFG P/N: BLM15AG121SN1D; ComponentLink1Description: Datasheet; Status: Released; Idc max: 550mA; Supplier 1: Digi-Key; HelpURL: https://www.digikey.com/product-detail/en/murata-electronics/BLM15AG121SN1D/490-1005-1-ND/584453; ComponentLink1URL: https://www.murata.com/en-us/products/productdata/8796740059166/ENFA0018.pdf; Height: 0.55mm; Supplier Part Number 1: 490-1005-1-ND
R1848 = 8315: as R10 on sheet 06 MIMXRT1170 PART2; Status: Released; Power: 1/20W; LOON: 470-00013-00; Gecko: 470-00013-00; XPN: 470-00013-00
TP25 TP30 TP31 = 178: as TP18-TP21 on sheet 06 MIMXRT1170 PART2; Status: Released; ComponentLink1URL: _PCB Feature
U5 = 117: as U5 on sheet 06 MIMXRT1170 PART2; Status: Released; Package: BGA-289; Category: Integrated Circuits (ICs); RoHS Compliant: Yes; ComponentLink1Description: Datasheet; ComponentLink1URL: https://drive.google.com/file/d/1FTzS3WjHycHWpbzAg-R_xAViv5bKJdqv/view; Height: 1.52mm

## Sheet 08 B2B.SchDoc: Luna v2
size A2; VersionControl_RevNumber: DNP; IsUserConfigurable: DNP; OrgAddr3: Sunrise FL 33323; OrgName: Pixels on Target; Page Create Date: March  8, 1995; Page Number: 5; Page Size: A2; Page Count: 14; OrgAddr2: Suite #104; RevCode: A; Doc: SCH30-00070-00; DsnPath: C:\Users\Carter Nichols\Documents\BitBucket boards (Cadence)\30-00070-00_Original\SCH30-00070-00.DSN; SchematicName: SC30-00070-00; PageName: 05-POWER IN; PageSize: A2; TopSchematic: True; Address4: United States
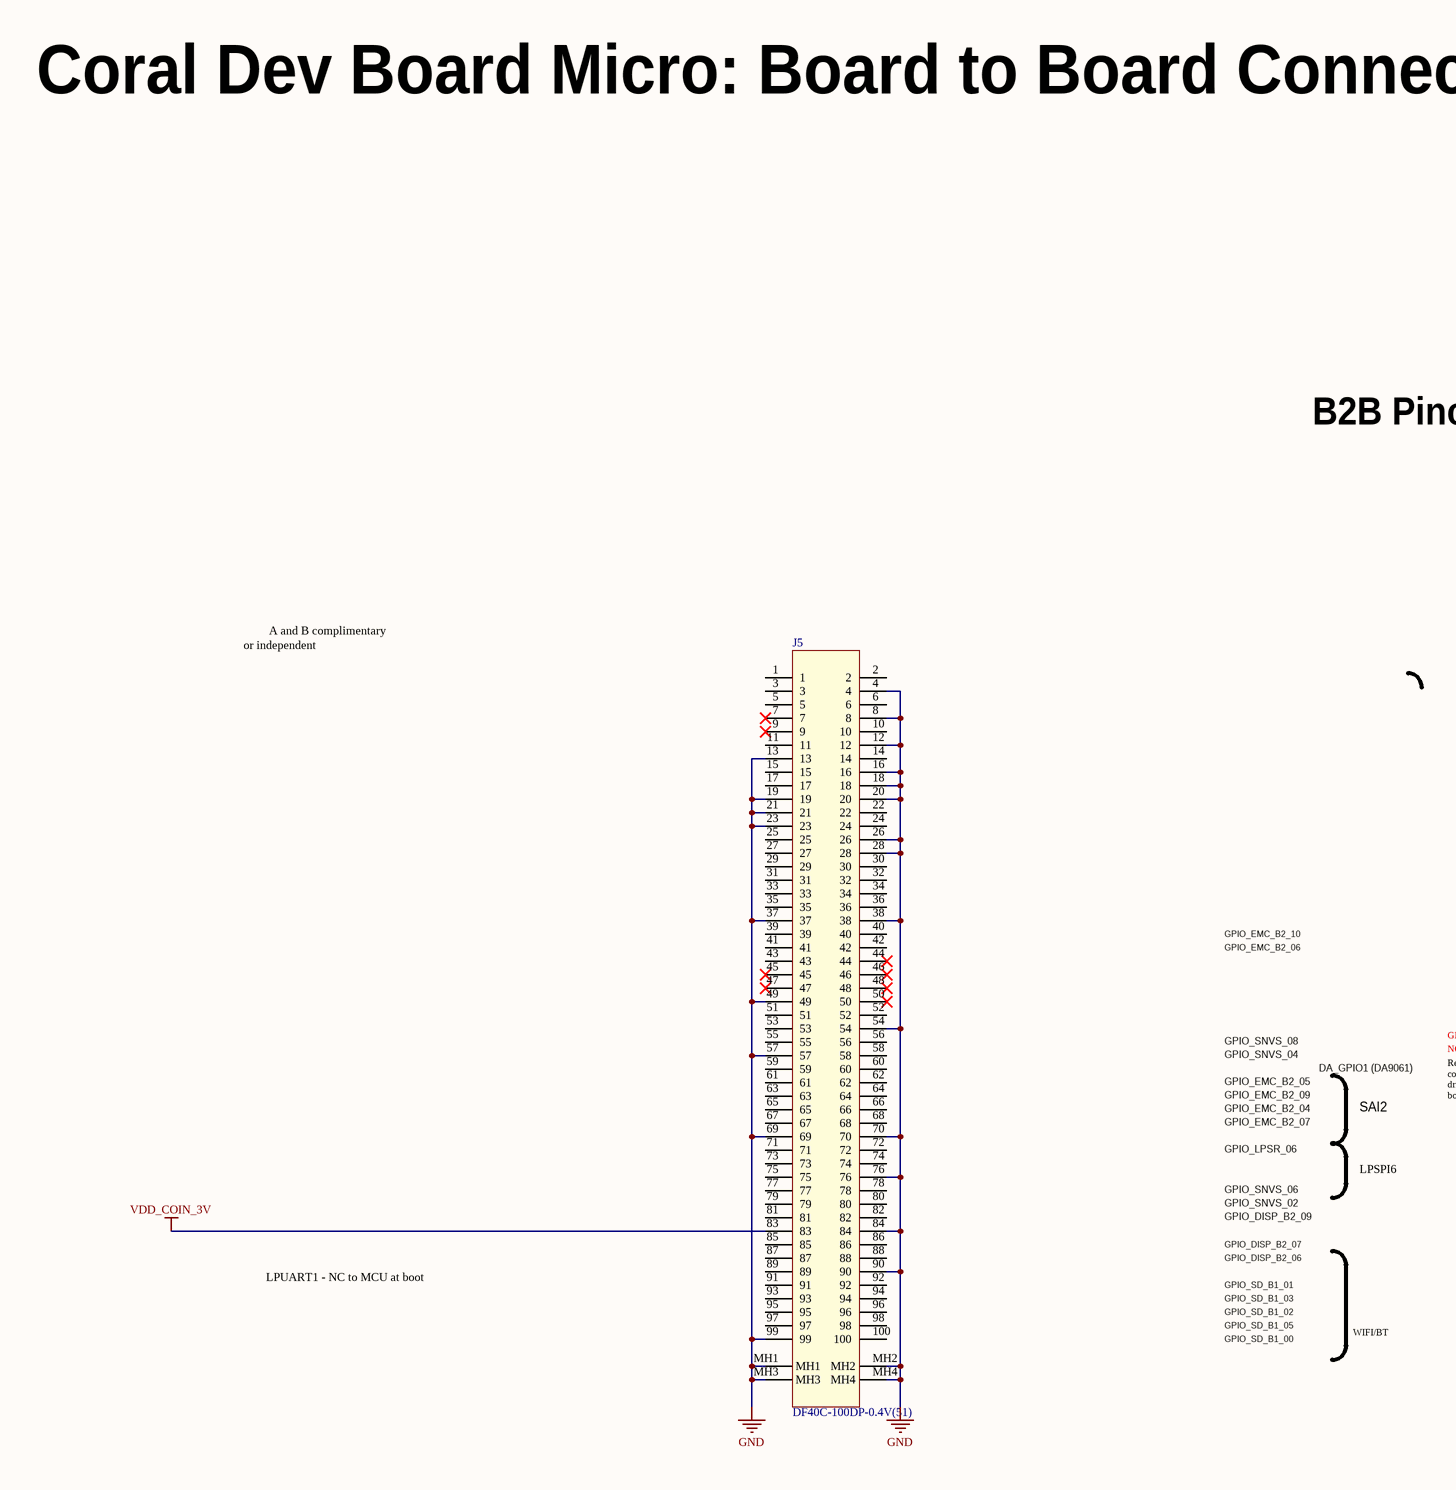
[diagram p12: 08 B2B.SchDoc, left]
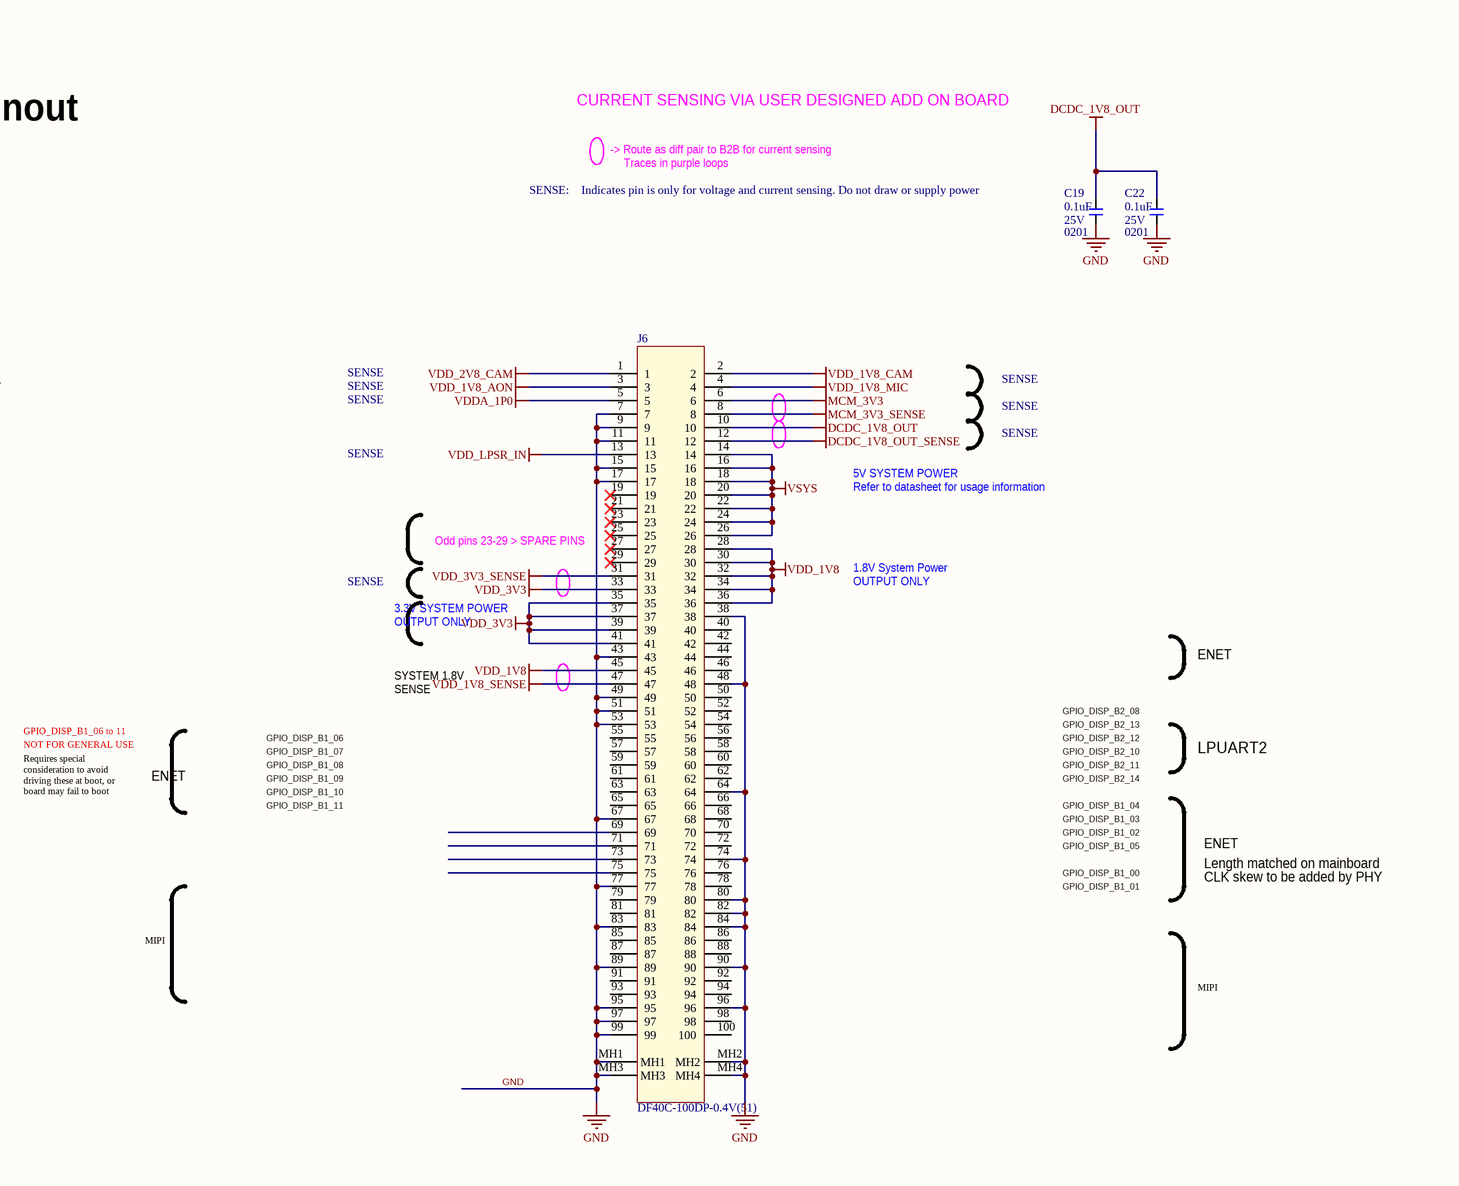
[diagram p13: 08 B2B.SchDoc, right]

### Parts
C19  value 0.1uF  Package: 0201  Voltage: 25V  [C0201Y]  (hidden comment: __Template_Cap)
C22  value 0.1uF  Package: 0201  Voltage: 25V  [C0201Y]  (hidden comment: __Template_Cap)
J5  MFG P/N: DF40C-100DP-0.4V(51)  [HIROSE_DF40C-100DP-0.4V(51)]
J6  MFG P/N: DF40C-100DP-0.4V(51)  [HIROSE_DF40C-100DP-0.4V(51)]

### Nets
DCDC_1V8_OUT: C19.1 C22.1 J6.10
DCDC_1V8_OUT_SENSE: J6.12
GND: C19.2 C22.2 J5.4 J5.8 J5.12 J5.13 J5.16 J5.18 J5.19 J5.20 J5.21 J5.23 J5.26 J5.28 J5.37 J5.38 J5.49 J5.54 J5.57 J5.69 J5.70 J5.76 J5.84 J5.90 J5.99 J5.MH1 J5.MH2 J5.MH3 J5.MH4 J6.7 J6.9 J6.11 J6.15 J6.17 J6.38 J6.43 J6.48 J6.49 J6.51 J6.53 J6.64 J6.67 J6.74 J6.77 J6.80 J6.82 J6.83 J6.84 J6.89 J6.90 J6.95 J6.96 J6.97 J6.99 J6.MH1 J6.MH2 J6.MH3 J6.MH4
MCM_3V3: J6.6
MCM_3V3_SENSE: J6.8
VDD_1V8: J6.28 J6.30 J6.32 J6.34 J6.36 J6.45
VDD_1V8_AON: J6.3
VDD_1V8_CAM: J6.2
VDD_1V8_MIC: J6.4
VDD_1V8_SENSE: J6.47
VDD_2V8_CAM: J6.1
VDD_3V3: J6.33 J6.35 J6.37 J6.39 J6.41
VDD_3V3_SENSE: J6.31
VDD_COIN_3V: J5.83
VDD_LPSR_IN: J6.13
VDDA_1P0: J6.5
VSYS: J6.14 J6.16 J6.18 J6.20 J6.22 J6.24 J6.26

Not connected (* = marked no-connect by the designer): J5 1 2 3 5 6 7* 9* 10 11 14 15 17 22 24 25 27 29 30 31 32 33 34 35 36 39 40 41 42 43 44* 45* 46* 47* 48* 50* 51 52 53 55 56 58 59 60 61 62 63 64 65 66 67 68 71 72 73 74 75 77 78 79 80 81 82 85 86 87 88 89 91 92 93 94 95 96 97 98 100; J6 19* 21* 23* 25* 27* 29* 40 42 44 46 50 52 54 55 56 57 58 59 60 61 62 63 65 66 68 69 70 71 72 73 75 76 78 79 81 85 86 87 88 91 92 93 94 98 100

### Notes on the sheet
- Coral Dev Board Micro: Board to Board Connector
- B2B Pinout
- CURRENT SENSING VIA USER DESIGNED ADD ON BOARD
- -> Route as diff pair to B2B for current sensing
- (near C19) SENSE:    Indicates pin is only for voltage and current sensing. Do not draw or supply power
- Traces in purple loops
- or independent
- A and B complimentary
- SENSE
- 5V SYSTEM POWER
- Refer to datasheet for usage information
- (near J6) Odd pins 23-29 > SPARE PINS
- 3.3V SYSTEM POWER
- OUTPUT ONLY
- 1.8V System Power
- GPIO_EMC_B2_06
- GPIO_EMC_B2_10
- SYSTEM 1.8V
- ENET
- GPIO_SNVS_04
- GPIO_SNVS_08
- NOT FOR GENERAL USE
- GPIO_DISP_B1_06 to 11
- GPIO_DISP_B1_06
- GPIO_DISP_B1_07
- GPIO_DISP_B2_10
- GPIO_DISP_B2_13
- GPIO_DISP_B2_08
- GPIO_DISP_B2_12
- LPUART2
- GPIO_EMC_B2_04
- GPIO_EMC_B2_05
- GPIO_EMC_B2_07
- GPIO_EMC_B2_09
- DA_GPIO1 (DA9061)
- SAI2
- Requires special consideration to avoid driving these at boot, or board may fail to boot
- GPIO_DISP_B1_08
- GPIO_DISP_B1_09
- GPIO_DISP_B1_10
- GPIO_DISP_B1_11
- GPIO_DISP_B2_11
- GPIO_DISP_B1_02
- GPIO_DISP_B1_03
- GPIO_DISP_B1_04
- GPIO_DISP_B2_14
- GPIO_SNVS_06
- GPIO_LPSR_06
- LPSPI6
- GPIO_DISP_B1_00
- GPIO_DISP_B1_01
- GPIO_DISP_B1_05
- Length matched on mainboard
- CLK skew to be added by PHY
- GPIO_SNVS_02
- GPIO_DISP_B2_09
- GPIO_DISP_B2_07
- GPIO_DISP_B2_06
- MIPI
- LPUART1 - NC to MCU at boot
- GPIO_SD_B1_01
- GPIO_SD_B1_02
- GPIO_SD_B1_03
- GPIO_SD_B1_05
- WIFI/BT
- GPIO_SD_B1_00
- Title
- Size:
- Date:
- File:
- A2
- Number:
- Time:
- Revision:
- Sheet
- of

### Library data of the parts
C19 C22 = 386: CAP, CER, X5R, 0.1uF, 25V, 20%, 0201, 0.33mm T; ID: 386; MFG: MURATA; MFG P/N: GRM033R61E104ME14D; XPN: 150-01204-00; Status: Released; Dielectric: X5R; Tolerance: 20%; Height: 0.33mm T; ComponentLink1Description: Datasheet; COMMON: 150-01204-00; LOON: 150-01204-00; Gecko: 150-01204-00
J5 J6 = 897: CONN, HDR, VERT, 2x50, 0.4MM P, 1.14MM H, GOLD, SMD; ID: 897; MFG: Hirose Electric Co Ltd; Connector Type: Plug, Outer Shroud Contacts; Pitch: 0.40mm; Number of Positions: 100; Gender: Male; Status: Released; RoHS Compliant: Yes; Mounting Type: Surface Mount; Orientation: Vertical; Number of Rows: 2; Features: Solder Retention; Supplier 1: Digi-Key; HelpURL: https://www.digikey.com/product-detail/en/hirose-electric-co-ltd/DF40C-100DP-0.4V-51/H11614CT-ND/1969494; ComponentLink1Description: Datasheet; ComponentLink1URL: https://www.hirose.com/product/download/?distributor=digikey&type=2d&lang=en&num=DF40C-100DP-0.4V(51); Supplier Part Number 1: H11614CT-ND

## Sheet 09 Parallel Camera.SchDoc: Luna v2
size A2; VersionControl_RevNumber: DNP; IsUserConfigurable: DNP; OrgAddr3: Sunrise FL 33323; OrgName: Pixels on Target; Page Create Date: March  8, 1995; Page Number: 5; Page Size: A2; Page Count: 14; OrgAddr2: Suite #104; RevCode: A; Doc: SCH30-00070-00; DsnPath: C:\Users\Carter Nichols\Documents\BitBucket boards (Cadence)\30-00070-00_Original\SCH30-00070-00.DSN; SchematicName: SC30-00070-00; PageName: 05-POWER IN; PageSize: A2; TopSchematic: True; Address4: United States
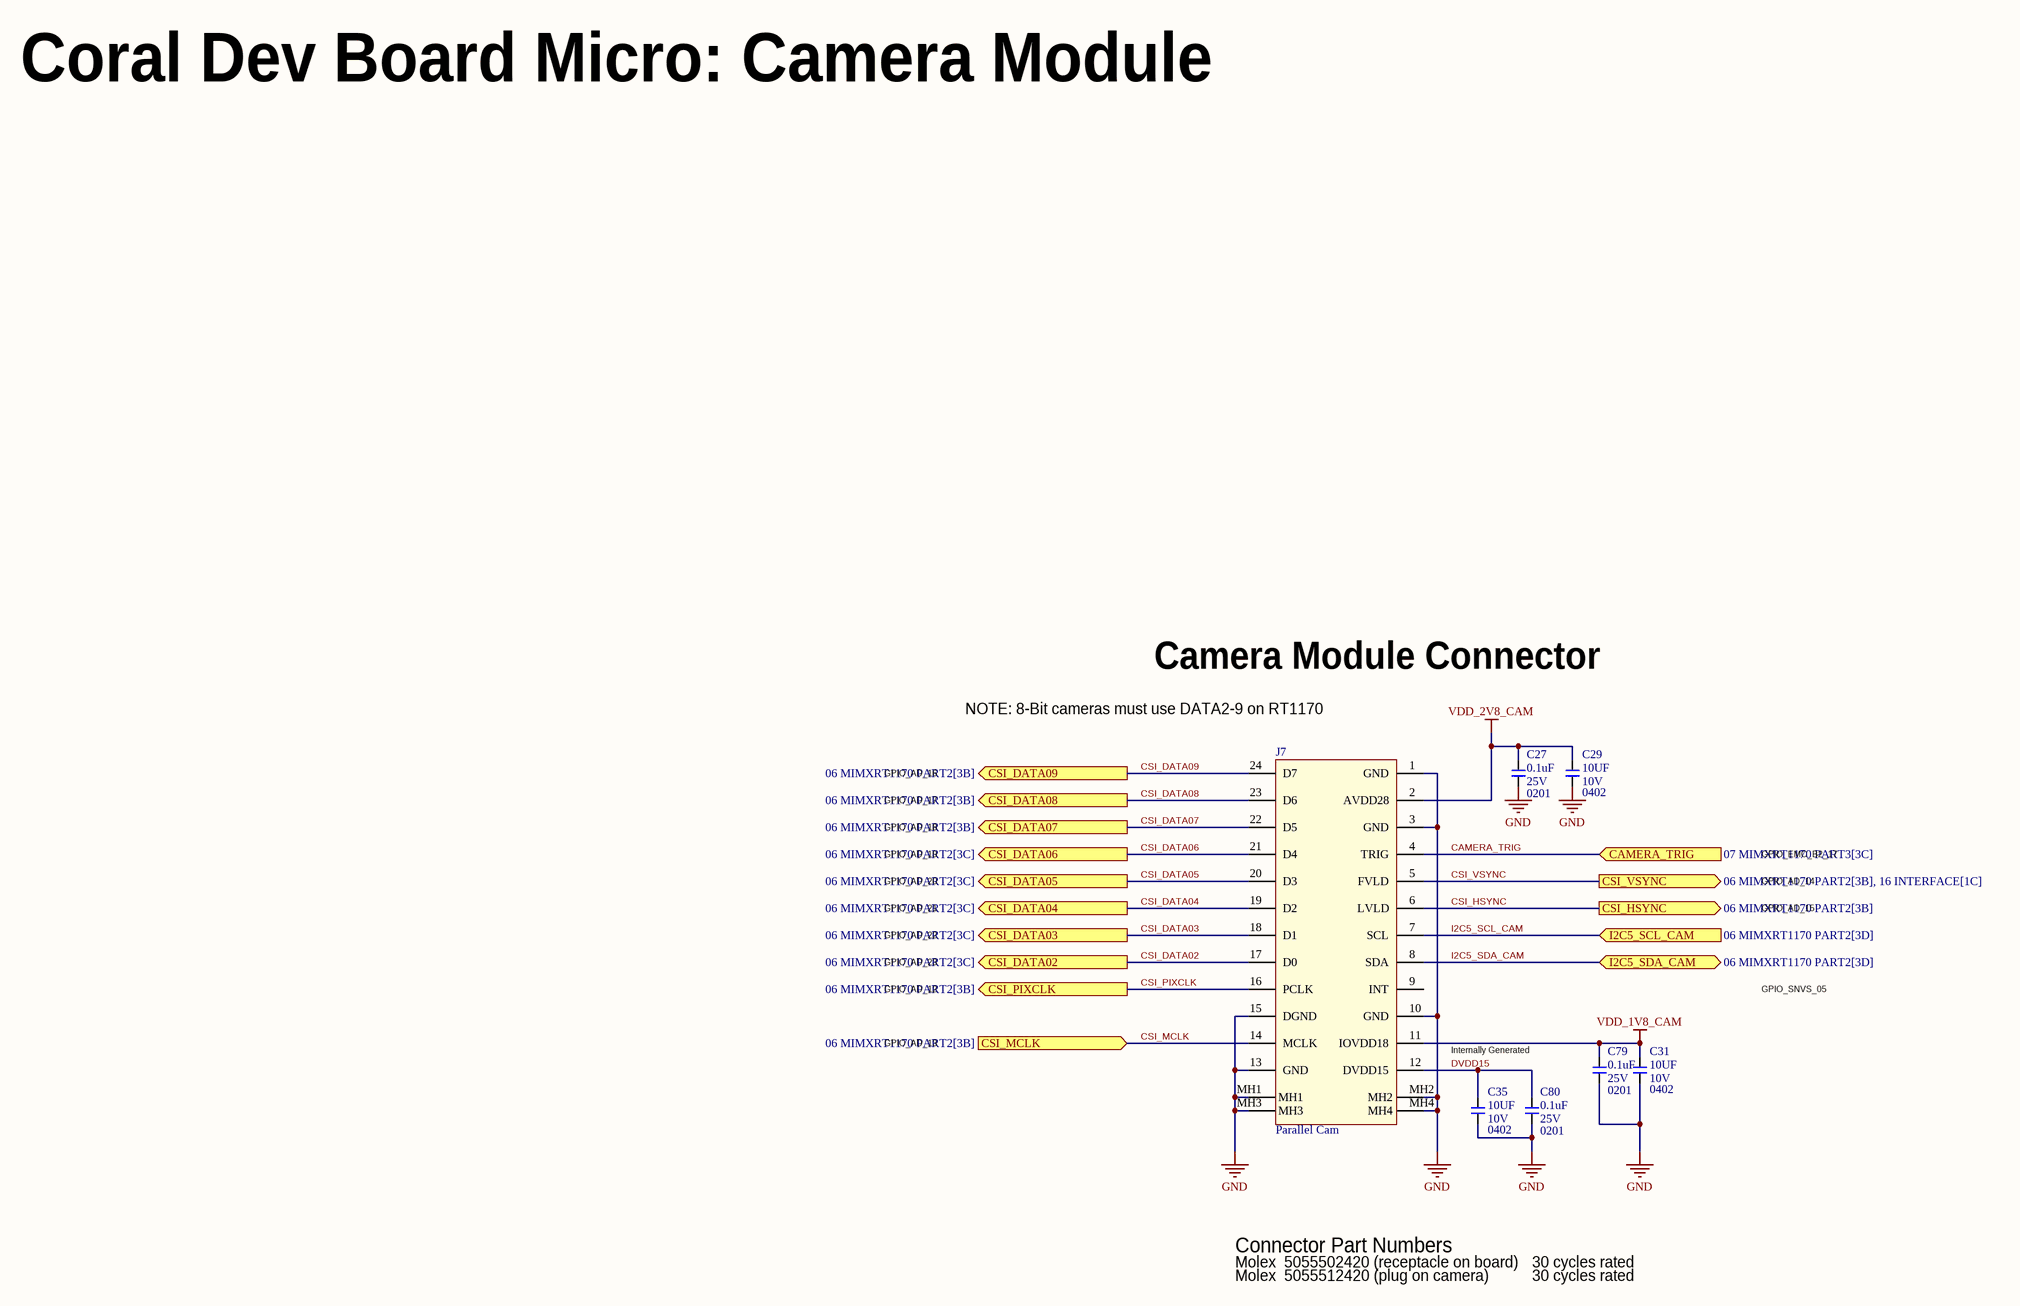
[diagram p14: 09 Parallel Camera.SchDoc]

### Parts
C27  value 0.1uF  Package: 0201  Voltage: 25V  [C0201Y]  (hidden comment: __Template_Cap)
C29  value 10UF  Package: 0402  Voltage: 10V  [C0402]  (hidden comment: __Template_Cap)
C31  value 10UF  Package: 0402  Voltage: 10V  [C0402]  (hidden comment: __Template_Cap)
C35  value 10UF  Package: 0402  Voltage: 10V  [C0402]  (hidden comment: __Template_Cap)
C79  value 0.1uF  Package: 0201  Voltage: 25V  [C0201Y]  (hidden comment: __Template_Cap)
C80  value 0.1uF  Package: 0201  Voltage: 25V  [C0201Y]  (hidden comment: __Template_Cap)
J7  MFG P/N: Parallel Cam  [Molex_5037722410_HM01B0]  (hidden comment: 1087)

### Ports
CAMERA_TRIG (in, see 07 MIMXRT1170 PART3[3C]), CSI_DATA02 (out, see 06 MIMXRT1170 PART2[3C]), CSI_DATA03 (out, see 06 MIMXRT1170 PART2[3C]), CSI_DATA04 (out, see 06 MIMXRT1170 PART2[3C]), CSI_DATA05 (out, see 06 MIMXRT1170 PART2[3C]), CSI_DATA06 (out, see 06 MIMXRT1170 PART2[3C]), CSI_DATA07 (out, see 06 MIMXRT1170 PART2[3B]), CSI_DATA08 (out, see 06 MIMXRT1170 PART2[3B]), CSI_DATA09 (out, see 06 MIMXRT1170 PART2[3B]), CSI_HSYNC (out, see 06 MIMXRT1170 PART2[3B]), CSI_MCLK (in, see 06 MIMXRT1170 PART2[3B]), CSI_PIXCLK (out, see 06 MIMXRT1170 PART2[3B]), CSI_VSYNC (out, see 06 MIMXRT1170 PART2[3B], 16 INTERFACE[1C]), I2C5_SCL_CAM (in, see 06 MIMXRT1170 PART2[3D]), I2C5_SDA_CAM (bidir, see 06 MIMXRT1170 PART2[3D])

### Nets
GND: C27.2 C29.2 C31.2 C35.2 C79.2 C80.2 J7.1(GND) J7.3(GND) J7.10(GND) J7.13(GND) J7.15(DGND) J7.MH1 J7.MH2 J7.MH3 J7.MH4
VDD_1V8_CAM: C31.1 C79.1 J7.11(IOVDD18)
VDD_2V8_CAM: C27.1 C29.1 J7.2(AVDD28)
CAMERA_TRIG: J7.4(TRIG) ; port CAMERA_TRIG
CSI_DATA02: J7.17(D0) ; port CSI_DATA02
CSI_DATA03: J7.18(D1) ; port CSI_DATA03
CSI_DATA04: J7.19(D2) ; port CSI_DATA04
CSI_DATA05: J7.20(D3) ; port CSI_DATA05
CSI_DATA06: J7.21(D4) ; port CSI_DATA06
CSI_DATA07: J7.22(D5) ; port CSI_DATA07
CSI_DATA08: J7.23(D6) ; port CSI_DATA08
CSI_DATA09: J7.24(D7) ; port CSI_DATA09
CSI_HSYNC: J7.6(LVLD) ; port CSI_HSYNC
CSI_MCLK: J7.14(MCLK) ; port CSI_MCLK
CSI_PIXCLK: J7.16(PCLK) ; port CSI_PIXCLK
CSI_VSYNC: J7.5(FVLD) ; port CSI_VSYNC
DVDD15: C35.1 C80.1 J7.12(DVDD15)
I2C5_SCL_CAM: J7.7(SCL) ; port I2C5_SCL_CAM
I2C5_SDA_CAM: J7.8(SDA) ; port I2C5_SDA_CAM

Not connected (* = marked no-connect by the designer): J7 9(INT)

### Notes on the sheet
- Coral Dev Board Micro: Camera Module
- NOTE: 8-Bit cameras must use DATA2-9 on RT1170
- Camera Module Connector
- GPIO_AD_16
- GPIO_AD_17
- GPIO_AD_18
- GPIO_AD_19
- GPIO_EMC_B2_17
- GPIO_AD_20
- GPIO_AD_21
- GPIO_AD_14
- GPIO_AD_15
- GPIO_AD_12
- GPIO_AD_22
- GPIO_AD_23
- GPIO_SNVS_05
- GPIO_AD_13
- Internally Generated
- Connector Part Numbers
- Molex  5055502420 (receptacle on board)
- Molex  5055512420 (plug on camera)
- 30 cycles rated
- Title
- Size:
- Date:
- File:
- A2
- Number:
- Time:
- Revision:
- Sheet
- of

### Library data of the parts
C27 C79 C80 = 386: as C19 on sheet 08 B2B; Status: Released; Dielectric: X5R; Tolerance: 20%; Height: 0.33mm T; ComponentLink1Description: Datasheet; COMMON: 150-01204-00; LOON: 150-01204-00; Gecko: 150-01204-00
C29 C31 C35 = 215: CAP, CER, X5R, 10uF, 10V, 20%, 0402, 0.7mm T; ID: 215; MFG: SAMSUNG; MFG P/N: CL05A106MP5NUNC; XPN: 150-00376-00; PROXY: Use ID #1342; EES: 150-04565-00; Status: Released; Dielectric: X5R; Tolerance: 20%; Height: 0.7mm T; ComponentLink1Description: Datasheet; COMMON: 150-00376-00; LOON: 150-00376-00; Gecko: 150-00376-00
J7 = 1087: HM01B0, CONN, RCPT, OUTER SHROUD, 2x12 PIN, 0.4MM P, 0.65MM H, GOLD, SM; MFG: Molex; Connector Type: Receptacle; Number of Positions: 24; Row Spacing: 2.35mm; ID: 1087; Status: Released; RoHS Compliant: Yes; Mounting Type: Surface Mount; Orientation: Vertical; Pitch: 0.4mm; Number of Rows: 2; Gender: Receptacle; Features: Outer Shroud Contacts; Supplier 1: Digi-Key; HelpURL: https://www.digikey.com/product-detail/en/molex/5037722410/WM6251CT-ND/2794320; ComponentLink1Description: Datasheet; ComponentLink1URL: https://www.molex.com/pdm_docs/sd/5037722410_sd.pdf; Height: 0.76mm; Supplier Part Number 1: WM6251CT-ND; ComponentLink2Description: HMB01B0 Datasheet; ComponentLink2URL: https://drive.google.com/a/google.com/file/d/1hz92MYY5mTVHUf_ZbvAIbaEPUMPymuL2/view?usp=sharing